# Altium project R01L_F.PrjPCB (part 2 of 3)

## Sheet 11_SDIO_SDMMC.SchDoc: P30L
size A3; Organization: 六零加智能科技; Address4: www.nidone.com.cn; DocumentNumber: kang jin; Revision: 1.0; SheetNumber: 11; SheetTotal: 23
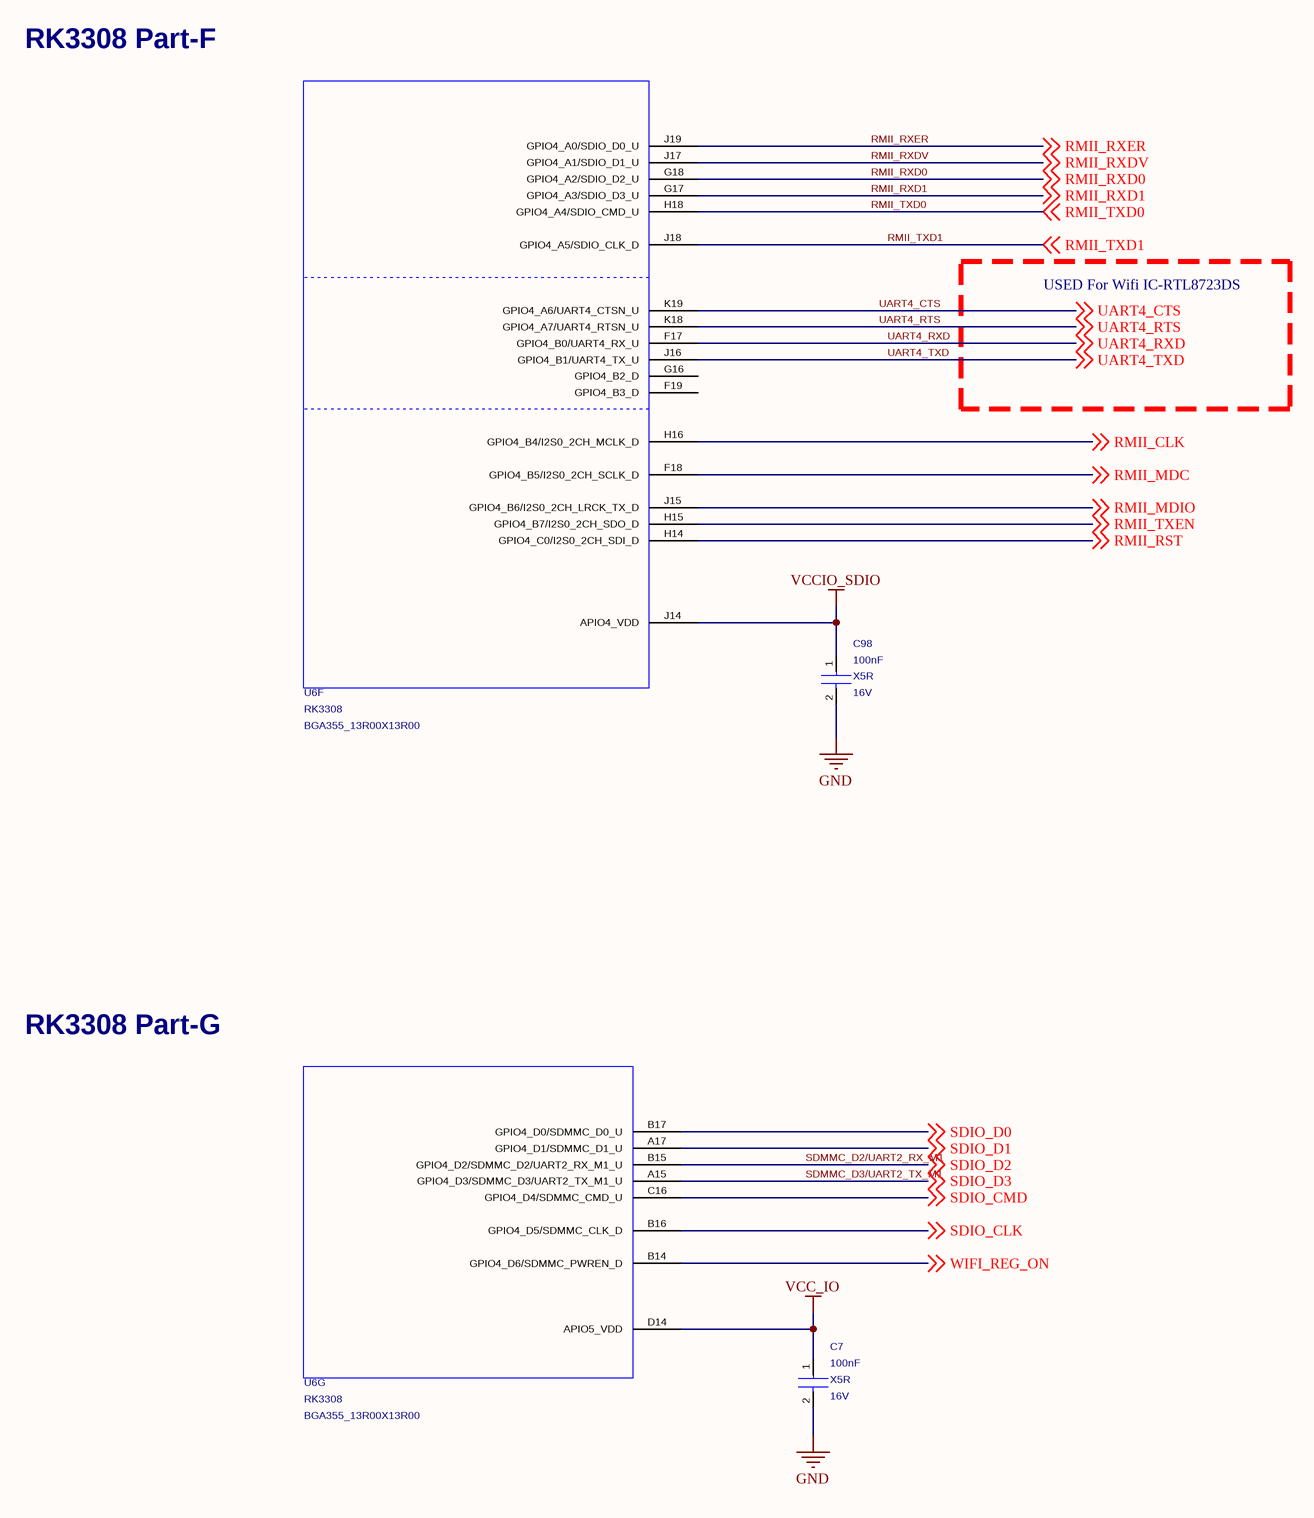
[diagram p19: 11_SDIO_SDMMC.SchDoc]

### Parts
C7  value 100nF  Voltage: 16V  Dielectric: X5R  [C0402]  (hidden comment: CAP_NP_2)
C98  value 100nF  Dielectric: X5R  Voltage: 16V  [C0402]  (hidden comment: CAP_NP_2)
U6  RK3308  [BGA355_13R00X13R00]  (parts F,G of 14)

### Nets
GND: C7.2 C98.2
VCC_IO: C7.1 C98.1 U6.D14(APIO5_VDD) U6.J14(APIO4_VDD)  [also labelled VCCIO_SDIO]
RMII_CLK: U6.H16(GPIO4_B4/I2S0_2CH_MCLK_D) ; off-sheet RMII_CLK
RMII_MDC: U6.F18(GPIO4_B5/I2S0_2CH_SCLK_D) ; off-sheet RMII_MDC
RMII_MDIO: U6.J15(GPIO4_B6/I2S0_2CH_LRCK_TX_D) ; off-sheet RMII_MDIO
RMII_RST: U6.H14(GPIO4_C0/I2S0_2CH_SDI_D) ; off-sheet RMII_RST
RMII_RXD0: U6.G18(GPIO4_A2/SDIO_D2_U) ; off-sheet RMII_RXD0
RMII_RXD1: U6.G17(GPIO4_A3/SDIO_D3_U) ; off-sheet RMII_RXD1
RMII_RXDV: U6.J17(GPIO4_A1/SDIO_D1_U) ; off-sheet RMII_RXDV
RMII_RXER: U6.J19(GPIO4_A0/SDIO_D0_U) ; off-sheet RMII_RXER
RMII_TXD0: U6.H18(GPIO4_A4/SDIO_CMD_U) ; off-sheet RMII_TXD0
RMII_TXD1: U6.J18(GPIO4_A5/SDIO_CLK_D) ; off-sheet RMII_TXD1
RMII_TXEN: U6.H15(GPIO4_B7/I2S0_2CH_SDO_D) ; off-sheet RMII_TXEN
SDIO_CLK: U6.B16(GPIO4_D5/SDMMC_CLK_D) ; off-sheet SDIO_CLK
SDIO_CMD: U6.C16(GPIO4_D4/SDMMC_CMD_U) ; off-sheet SDIO_CMD  [project net RTL8723DS_CMD]
SDIO_D0: U6.B17(GPIO4_D0/SDMMC_D0_U) ; off-sheet SDIO_D0  [project net RTL8723DS_D0]
SDIO_D1: U6.A17(GPIO4_D1/SDMMC_D1_U) ; off-sheet SDIO_D1  [project net RTL8723DS_D1]
SDIO_D2: U6.B15(GPIO4_D2/SDMMC_D2/UART2_RX_M1_U) ; off-sheet SDIO_D2  [also labelled SDMMC_D2/UART2_RX_M1]  [project net RTL8723DS_D2]
SDIO_D3: U6.A15(GPIO4_D3/SDMMC_D3/UART2_TX_M1_U) ; off-sheet SDIO_D3  [also labelled SDMMC_D3/UART2_TX_M1]  [project net RTL8723DS_D3]
UART4_CTS: U6.K19(GPIO4_A6/UART4_CTSN_U) ; off-sheet UART4_CTS
UART4_RTS: U6.K18(GPIO4_A7/UART4_RTSN_U) ; off-sheet UART4_RTS
UART4_RXD: U6.F17(GPIO4_B0/UART4_RX_U) ; off-sheet UART4_RXD
UART4_TXD: U6.J16(GPIO4_B1/UART4_TX_U) ; off-sheet UART4_TXD
WIFI_REG_ON: U6.B14(GPIO4_D6/SDMMC_PWREN_D) ; off-sheet WIFI_REG_ON

Not connected (* = marked no-connect by the designer): U6 F19(GPIO4_B3_D) G16(GPIO4_B2_D)

### Notes on the sheet
- RK3308 Part-F
- USED For Wifi IC-RTL8723DS
- RK3308 Part-G
- Title
- Size:
- Date:
- A3
- Engineer:
- Time:
- Revision:
- Sheet
- of
- File:

### Library data of the parts
C7 = CAP_NP_2: as C46 on sheet 04_POWER; PCB DECAL: C0402; Part_Type: C0402; RK_PN: C1005X5R1C104K050BA
C98 = CAP_NP_2: as C48 on sheet 04_POWER; PCB DECAL: C0402; Part_Type: C0402; Manufacturer_PN: C1005X5R1C104K050BA
U6 = RK3308: as U6 on sheet 04_POWER; Manufacturer_PN: RK3308; PCB DECAL: BGA355_13R00X13R00; Value: RK3308

## Sheet 12_GPIO_I2S0_PDM_SPDIF.SchDoc: P30L
size A2; Organization: 六零加智能科技; Address4: www.nidone.com.cn; DocumentNumber: Kang jin; Revision: 1.0; SheetNumber: 12; SheetTotal: 23
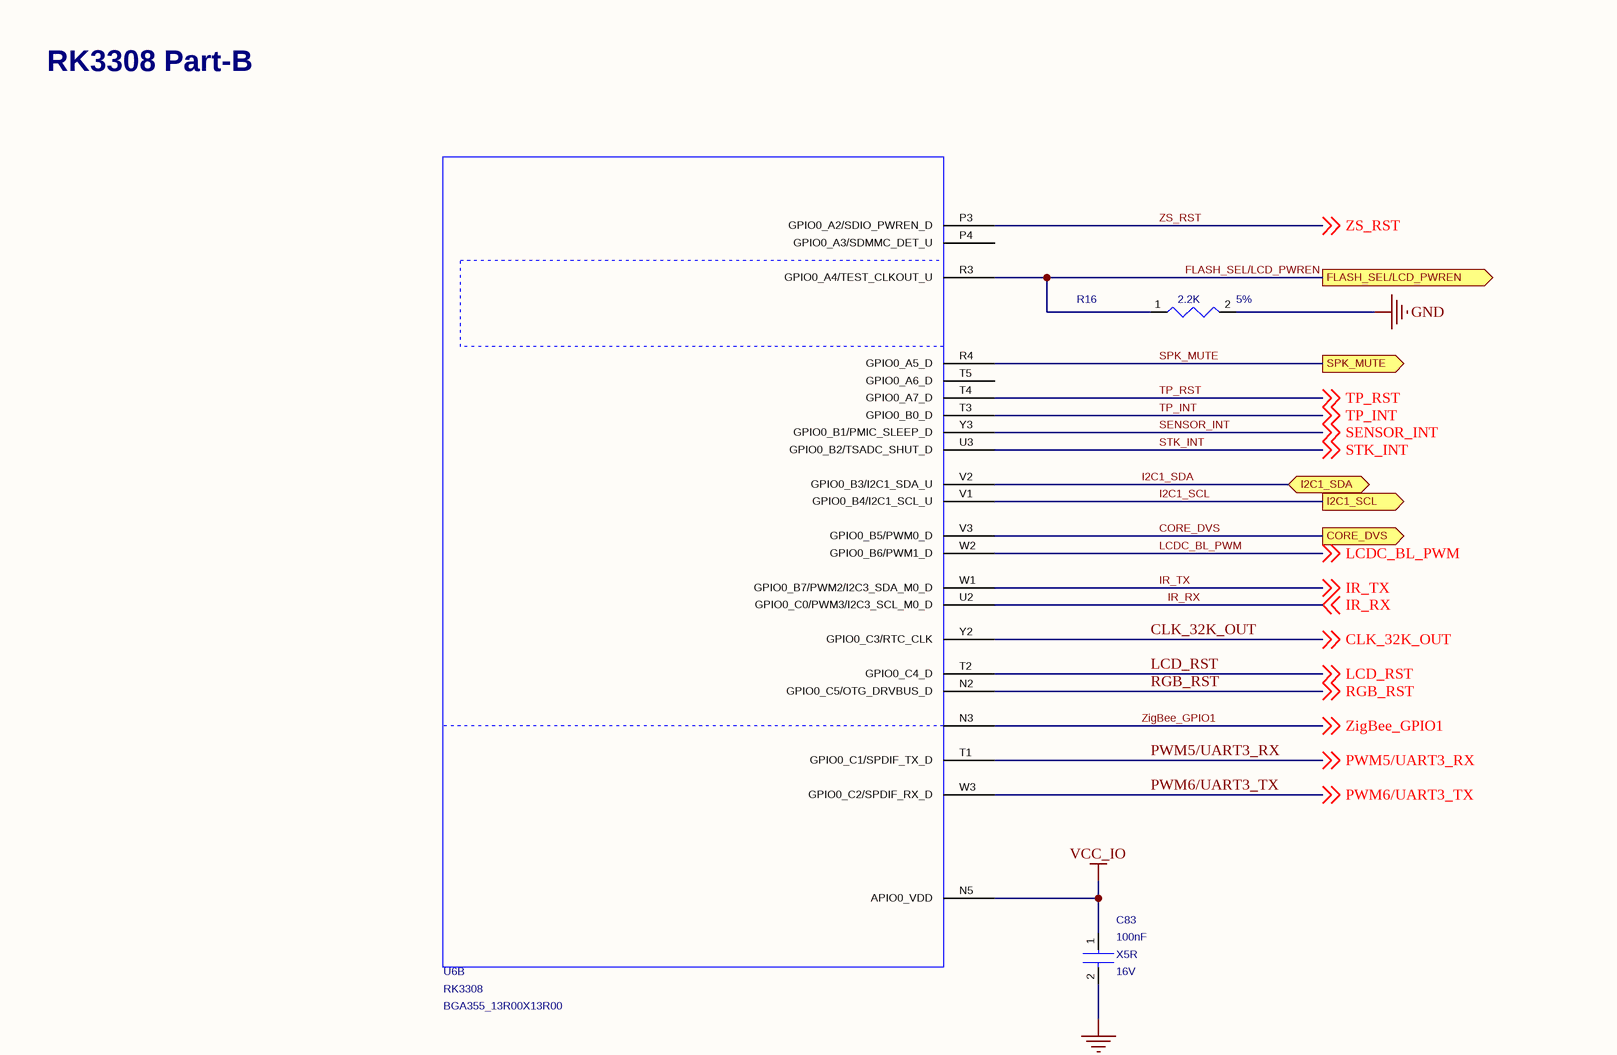
[diagram p20: 12_GPIO_I2S0_PDM_SPDIF.SchDoc, top left]
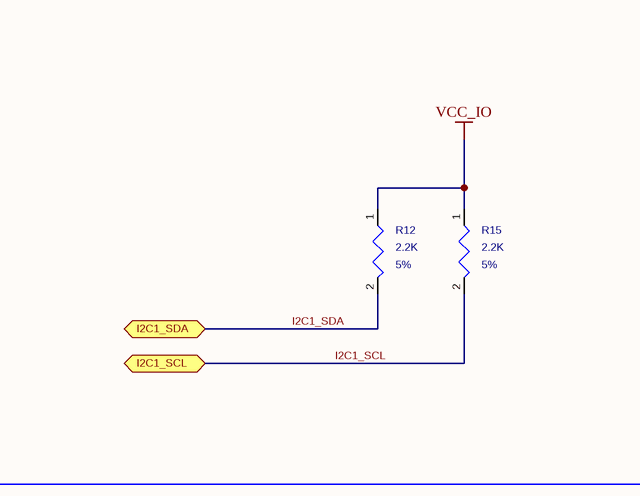
[diagram p21: 12_GPIO_I2S0_PDM_SPDIF.SchDoc, top right]
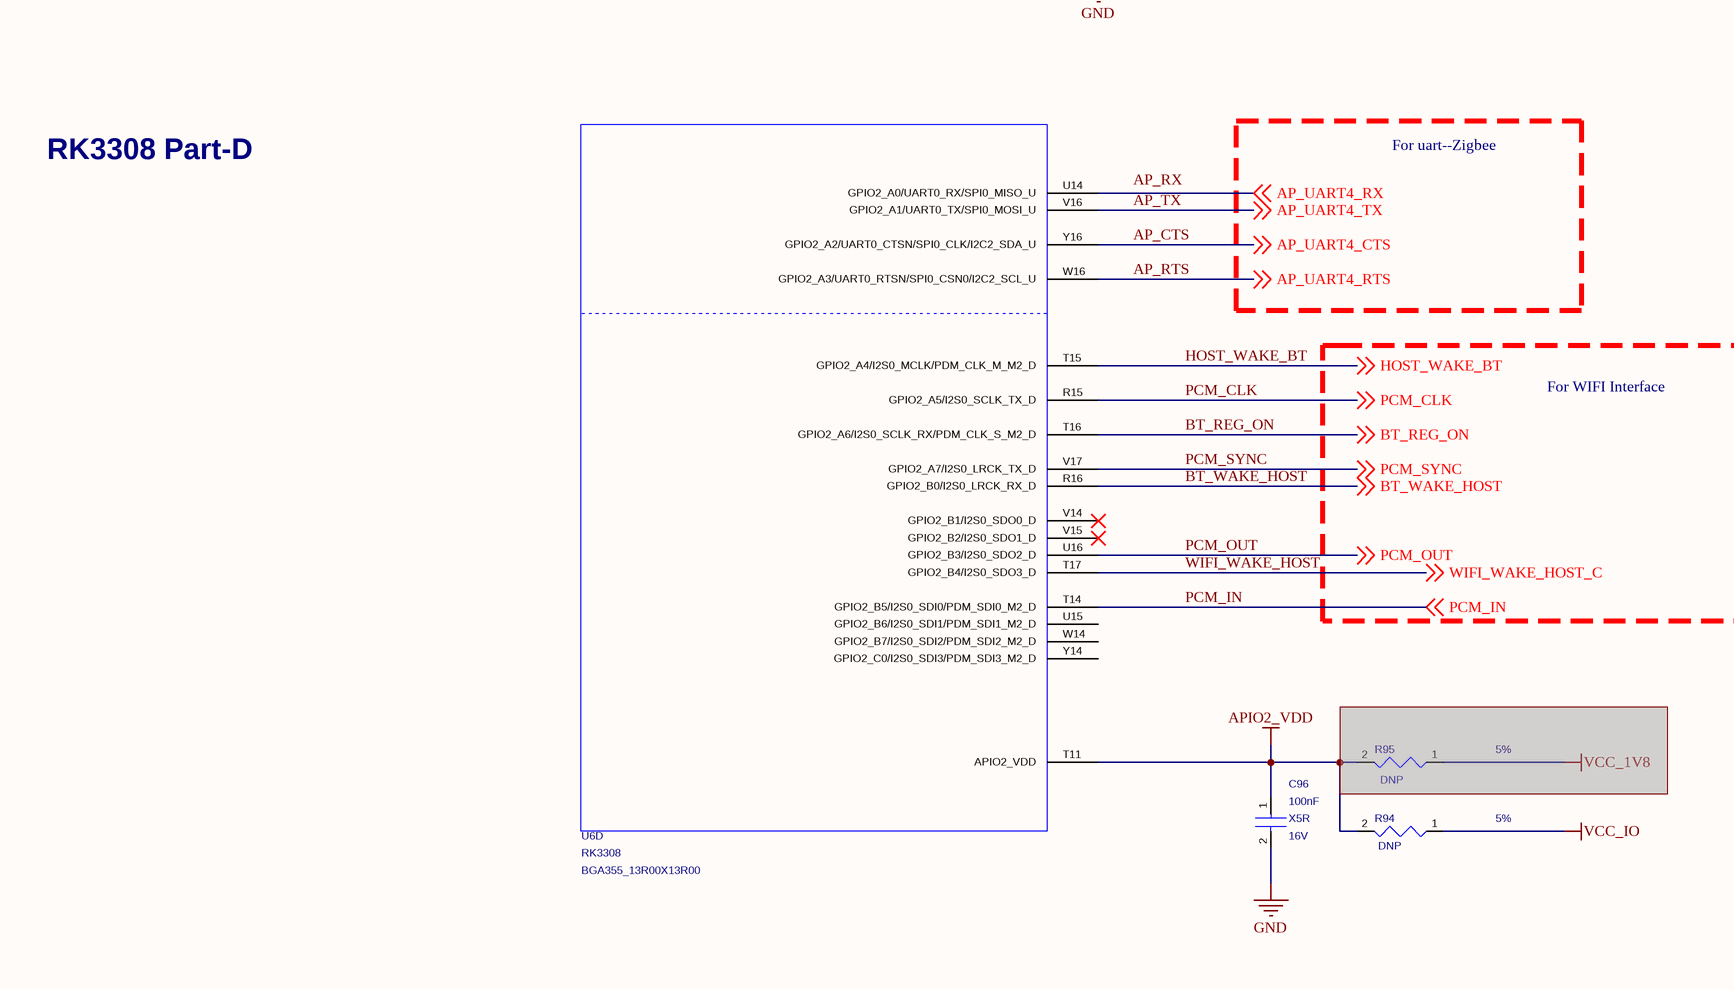
[diagram p22: 12_GPIO_I2S0_PDM_SPDIF.SchDoc, bottom left]

### Parts
C83  value 100nF  Voltage: 16V  Dielectric: X5R  [C0402]  (hidden comment: CAP_NP_2)
C96  value 100nF  Dielectric: X5R  Voltage: 16V  [C0402]  (hidden comment: CAP_NP_2)
R12  value 2.2K  Tolerance: 5%  [R0402]  (hidden comment: RESISTOR)
R15  value 2.2K  Tolerance: 5%  [R0402]  (hidden comment: RESISTOR)
R16  value 2.2K  Tolerance: 5%  [R0402]  (hidden comment: RESISTOR)
R94  Tolerance: 5%  Option: DNP  [R0402]  (hidden comment: RESISTOR)
R95  Tolerance: 5%  Option: DNP  [R0402]  (hidden comment: RESISTOR)  (masked out: inside a compile mask, not in the netlist)
U6  RK3308  [BGA355_13R00X13R00]  (parts B,D of 14)

### Ports
CORE_DVS (out), FLASH_SEL/LCD_PWREN (out), I2C1_SCL (bidir), I2C1_SCL (out), I2C1_SDA (bidir), SPK_MUTE (out)

### Nets
APIO2_VDD: C96.1 R94.2 U6.T11(APIO2_VDD)
GND: C83.2 C96.2 R16.2
VCC_IO: C83.1 R12.1 R15.1 R94.1 U6.N5(APIO0_VDD)
AP_CTS: U6.Y16(GPIO2_A2/UART0_CTSN/SPI0_CLK/I2C2_SDA_U) ; off-sheet AP_UART4_CTS  [also labelled AP_UART4_CTS]
AP_RTS: U6.W16(GPIO2_A3/UART0_RTSN/SPI0_CSN0/I2C2_SCL_U) ; off-sheet AP_UART4_RTS  [also labelled AP_UART4_RTS]
AP_TX: U6.V16(GPIO2_A1/UART0_TX/SPI0_MOSI_U) ; off-sheet AP_UART4_TX  [also labelled AP_UART4_TX]
AP_UART4_RX: U6.U14(GPIO2_A0/UART0_RX/SPI0_MISO_U) ; off-sheet AP_UART4_RX
BT_REG_ON: U6.T16(GPIO2_A6/I2S0_SCLK_RX/PDM_CLK_S_M2_D) ; off-sheet BT_REG_ON
BT_WAKE_HOST: U6.R16(GPIO2_B0/I2S0_LRCK_RX_D) ; off-sheet BT_WAKE_HOST
CLK_32K_OUT: U6.Y2(GPIO0_C3/RTC_CLK) ; off-sheet CLK_32K_OUT
CORE_DVS: U6.V3(GPIO0_B5/PWM0_D) ; port CORE_DVS
FLASH_SEL/LCD_PWREN: R16.1 U6.R3(GPIO0_A4/TEST_CLKOUT_U) ; port FLASH_SEL/LCD_PWREN
HOST_WAKE_BT: U6.T15(GPIO2_A4/I2S0_MCLK/PDM_CLK_M_M2_D) ; off-sheet HOST_WAKE_BT
I2C1_SCL: R15.2 U6.V1(GPIO0_B4/I2C1_SCL_U) ; port I2C1_SCL
I2C1_SDA: R12.2 U6.V2(GPIO0_B3/I2C1_SDA_U) ; port I2C1_SDA
IR_RX: U6.U2(GPIO0_C0/PWM3/I2C3_SCL_M0_D) ; off-sheet IR_RX
IR_TX: U6.W1(GPIO0_B7/PWM2/I2C3_SDA_M0_D) ; off-sheet IR_TX
LCD_RST: U6.T2(GPIO0_C4_D) ; off-sheet LCD_RST
LCDC_BL_PWM: U6.W2(GPIO0_B6/PWM1_D) ; off-sheet LCDC_BL_PWM
PCM_CLK: U6.R15(GPIO2_A5/I2S0_SCLK_TX_D) ; off-sheet PCM_CLK
PCM_IN: U6.T14(GPIO2_B5/I2S0_SDI0/PDM_SDI0_M2_D) ; off-sheet PCM_IN
PCM_OUT: U6.U16(GPIO2_B3/I2S0_SDO2_D) ; off-sheet PCM_OUT
PCM_SYNC: U6.V17(GPIO2_A7/I2S0_LRCK_TX_D) ; off-sheet PCM_SYNC
PWM5/UART3_RX: U6.T1(GPIO0_C1/SPDIF_TX_D) ; off-sheet PWM5/UART3_RX
PWM6/UART3_TX: U6.W3(GPIO0_C2/SPDIF_RX_D) ; off-sheet PWM6/UART3_TX
RGB_RST: U6.N2(GPIO0_C5/OTG_DRVBUS_D) ; off-sheet RGB_RST
SENSOR_INT: U6.Y3(GPIO0_B1/PMIC_SLEEP_D) ; off-sheet SENSOR_INT  [project net CH_INT]
SPK_MUTE: U6.R4(GPIO0_A5_D) ; port SPK_MUTE
STK_INT: U6.U3(GPIO0_B2/TSADC_SHUT_D) ; off-sheet STK_INT
TP_INT: U6.T3(GPIO0_B0_D) ; off-sheet TP_INT
TP_RST: U6.T4(GPIO0_A7_D) ; off-sheet TP_RST
WIFI_WAKE_HOST: U6.T17(GPIO2_B4/I2S0_SDO3_D) ; off-sheet WIFI_WAKE_HOST_C  [also labelled WIFI_WAKE_HOST_C]
ZigBee_GPIO1: U6.N3 ; off-sheet ZigBee_GPIO1  [project net RS485_EN]
ZS_RST: U6.P3(GPIO0_A2/SDIO_PWREN_D) ; off-sheet ZS_RST

Not connected (* = marked no-connect by the designer): U6 P4(GPIO0_A3/SDMMC_DET_U) T5(GPIO0_A6_D) U15(GPIO2_B6/I2S0_SDI1/PDM_SDI1_M2_D) V14(GPIO2_B1/I2S0_SDO0_D)* V15(GPIO2_B2/I2S0_SDO1_D)* W14(GPIO2_B7/I2S0_SDI2/PDM_SDI2_M2_D) Y14(GPIO2_C0/I2S0_SDI3/PDM_SDI3_M2_D)

### Notes on the sheet
- RK3308 Part-B
- RK3308 Part-D
- For uart--Zigbee
- For WIFI Interface
- Labels drawn without touching a wire or pin: AP_RX
- Title
- Size:
- Date:
- File:
- A2
- Engineer:
- Time:
- Revision:
- Sheet
- of

### Library data of the parts
C83 = CAP_NP_2: as C46 on sheet 04_POWER; Part_Type: C0402; RK_PN: C1005X5R1C104K050BA; PCB DECAL: C0402
C96 = CAP_NP_2: as C48 on sheet 04_POWER; Part_Type: C0402; Manufacturer_PN: C1005X5R1C104K050BA; PCB DECAL: C0402
R12 = RESISTOR: ?用厚膜电阻,2K2,+/-5%,R0402,1/16W.; Manufacturer_PN: RC0402JR-072K2L; Manufacturer: YAGEO; Created_by: YTL; Wattage: 1/16W; Priority: A; Source_Path: Z:\RK_STANDARD_LIBRARY\CADENCE_CIS\RK_DISCRETE.OLB; Part_Type: ?用厚膜电阻; RK_PN: RC0402JR-072K2L; PCB DECAL: R0402
R15 = RESISTOR: ?用厚膜电阻,2K2,+/-5%,R0402,1/16W.; Manufacturer: YAGEO; RK_PN: RC0402JR-072K2L; Priority: A; Wattage: 1/16W; Created_by: YTL; Source_Path: Z:\RK_STANDARD_LIBRARY\CADENCE_CIS\RK_DISCRETE.OLB; Part_Type: ?用厚膜电阻; Manufacturer_PN: RC0402JR-072K2L; PCB DECAL: R0402
R16 = RESISTOR: ?用厚膜电阻,2.2K,+/-5%,R0402,1/16W.; Manufacturer: YAGEO; RK_PN: RC0402JR-070RL; Priority: A; Wattage: 1/16W; Created_by: YTL; Source_Path: Z:\RK_STANDARD_LIBRARY\CADENCE_CIS\RK_DISCRETE.OLB; Number: 1; Part_Type: ?用厚膜电阻; Manufacturer_PN: RC0402JR-070RL; PCB DECAL: R0402
R94 R95 = RESISTOR: ?用厚膜电阻,0R,+/-5%,R0402,1/16W.; Manufacturer: YAGEO; RK_PN: RC0402JR-070RL; Priority: A; Wattage: 1/16W; Created_by: YTL; Source_Path: Z:\RK_STANDARD_LIBRARY\CADENCE_CIS\RK_DISCRETE.OLB; Number: 1; Part_Type: ?用厚膜电阻; Manufacturer_PN: RC0402JR-070RL; PCB DECAL: R0402; Value: 0R
U6 = RK3308: as U6 on sheet 04_POWER; Manufacturer_PN: RK3308; PCB DECAL: BGA355_13R00X13R00; Value: RK3308

## Sheet 13_ACODEC.SchDoc: P30L
size A2; Organization: 六零加智能科技; Address4: www.nidone.com.cn; DocumentNumber: kang jin; Revision: 1.0; SheetNumber: 13; SheetTotal: 23
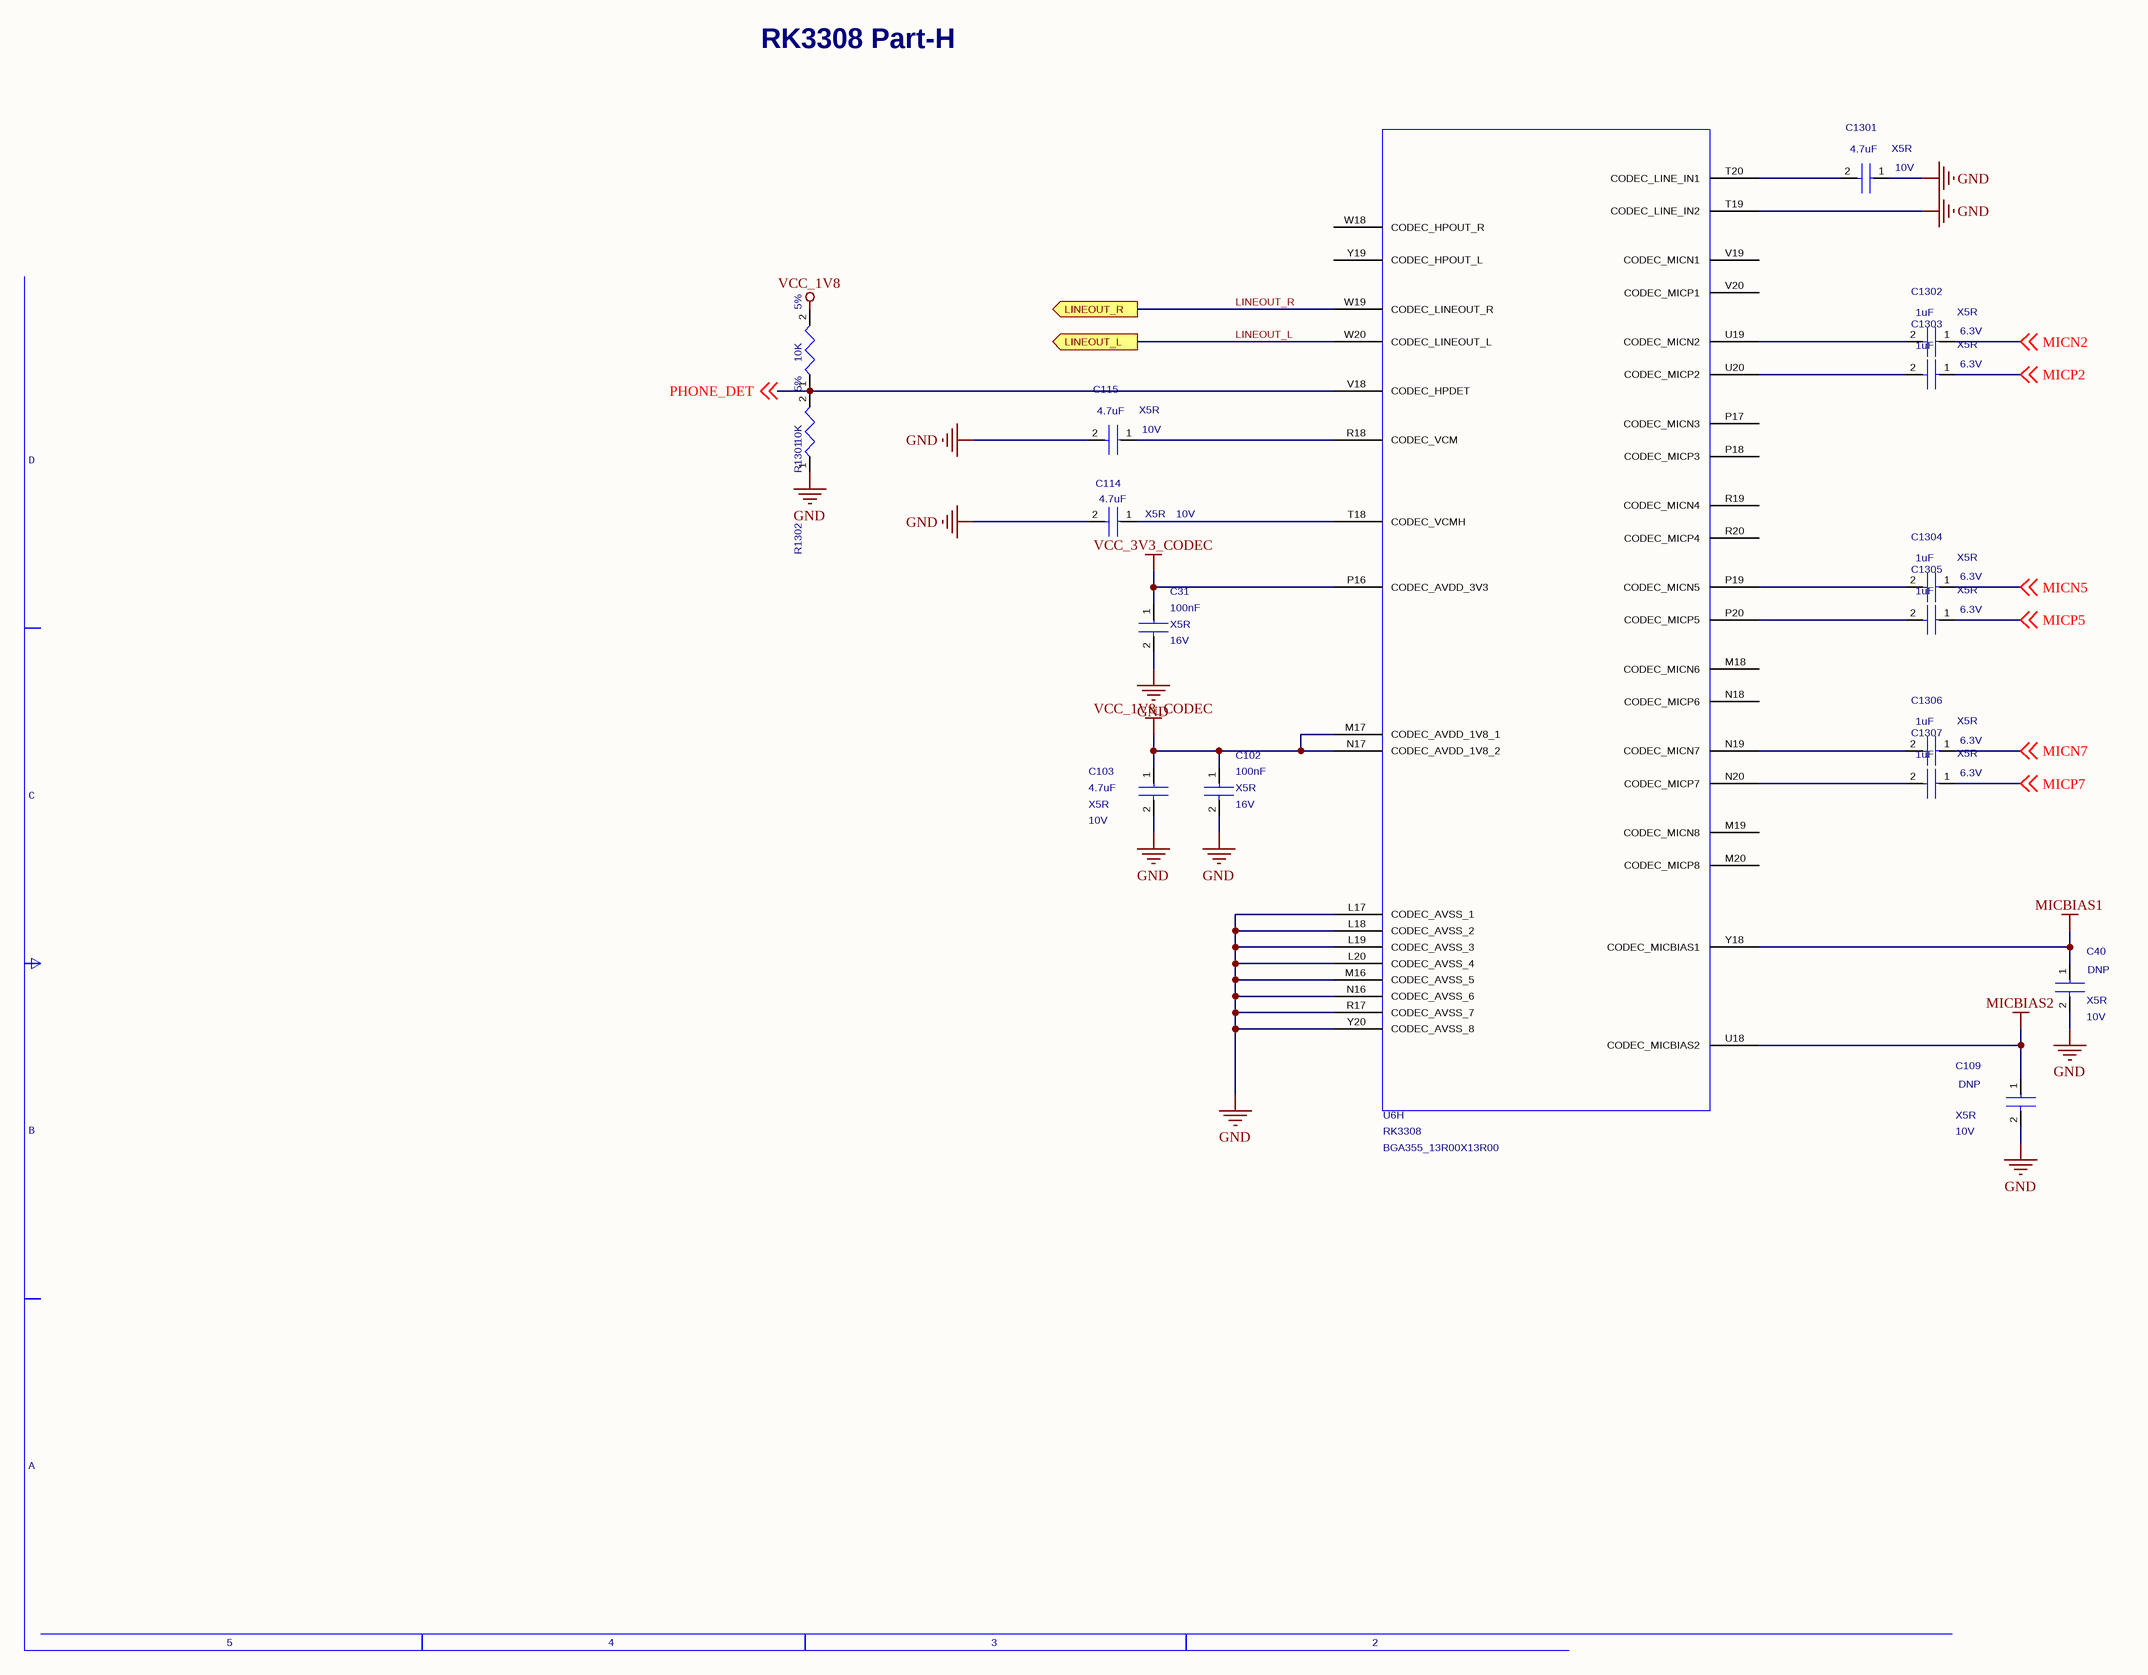
[diagram p23: 13_ACODEC.SchDoc]

### Parts
C31  value 100nF  Voltage: 16V  Dielectric: X5R  [C0402]  (hidden comment: CAP_NP_2)
C40  Dielectric: X5R  Voltage: 10V  Option: DNP  [C0402]  (hidden comment: CAP_NP_2)
C102  value 100nF  Dielectric: X5R  Voltage: 16V  [C0402]  (hidden comment: CAP_NP_2)
C103  value 4.7uF  Dielectric: X5R  Voltage: 10V  [C0402]  (hidden comment: CAP_NP_2)
C109  Voltage: 10V  Dielectric: X5R  Option: DNP  [C0402]  (hidden comment: CAP_NP_2)
C114  value 4.7uF  Voltage: 10V  Dielectric: X5R  [C0603]  (hidden comment: CAP_NP_2)
C115  value 4.7uF  Voltage: 10V  Dielectric: X5R  [C0603]  (hidden comment: CAP_NP_2)
C1301  value 4.7uF  Voltage: 10V  Dielectric: X5R  [C0603]  (hidden comment: CAP_NP_2)
C1302  value 1uF  Voltage: 6.3V  Dielectric: X5R  [C0402]  (hidden comment: CAP_NP_2)
C1303  value 1uF  Voltage: 6.3V  Dielectric: X5R  [C0402]  (hidden comment: CAP_NP_2)
C1304  value 1uF  Voltage: 6.3V  Dielectric: X5R  [C0402]  (hidden comment: CAP_NP_2)
C1305  value 1uF  Voltage: 6.3V  Dielectric: X5R  [C0402]  (hidden comment: CAP_NP_2)
C1306  value 1uF  Voltage: 6.3V  Dielectric: X5R  [C0402]  (hidden comment: CAP_NP_2)
C1307  value 1uF  Voltage: 6.3V  Dielectric: X5R  [C0402]  (hidden comment: CAP_NP_2)
R1301  value 10K  Tolerance: 5%  [R0402]  (hidden comment: RESISTOR)
R1302  value 10K  Tolerance: 5%  [R0402]  (hidden comment: RESISTOR)
U6  RK3308  [BGA355_13R00X13R00]  (part H of 14)

### Ports
LINEOUT_L (out), LINEOUT_R (out)

### Nets
GND: C31.2 C40.2 C102.2 C103.2 C109.2 C114.2 C115.2 C1301.1 R1302.1 U6.L17(CODEC_AVSS_1) U6.L18(CODEC_AVSS_2) U6.L19(CODEC_AVSS_3) U6.L20(CODEC_AVSS_4) U6.M16(CODEC_AVSS_5) U6.N16(CODEC_AVSS_6) U6.R17(CODEC_AVSS_7) U6.T19(CODEC_LINE_IN2) U6.Y20(CODEC_AVSS_8)
MICBIAS1: C40.1 U6.Y18(CODEC_MICBIAS1)
MICBIAS2: C109.1 U6.U18(CODEC_MICBIAS2)
VCC_1V8: R1301.2
VCC_1V8_CODEC: C102.1 C103.1 U6.M17(CODEC_AVDD_1V8_1) U6.N17(CODEC_AVDD_1V8_2)
VCC_3V3_CODEC: C31.1 U6.P16(CODEC_AVDD_3V3)
LINEOUT_L: U6.W20(CODEC_LINEOUT_L) ; port LINEOUT_L
LINEOUT_R: U6.W19(CODEC_LINEOUT_R) ; port LINEOUT_R
MICN2: C1302.1 ; off-sheet MICN2
MICN5: C1304.1 ; off-sheet MICN5
MICN7: C1306.1 ; off-sheet MICN7
MICP2: C1303.1 ; off-sheet MICP2
MICP5: C1305.1 ; off-sheet MICP5
MICP7: C1307.1 ; off-sheet MICP7
PHONE_DET: R1301.1 R1302.2 U6.V18(CODEC_HPDET) ; off-sheet PHONE_DET
NetC114_1: C114.1 U6.T18(CODEC_VCMH)
NetC115_1: C115.1 U6.R18(CODEC_VCM)
NetC1301_2: C1301.2 U6.T20(CODEC_LINE_IN1)
NetC1302_2: C1302.2 U6.U19(CODEC_MICN2)
NetC1303_2: C1303.2 U6.U20(CODEC_MICP2)
NetC1304_2: C1304.2 U6.P19(CODEC_MICN5)
NetC1305_2: C1305.2 U6.P20(CODEC_MICP5)
NetC1306_2: C1306.2 U6.N19(CODEC_MICN7)
NetC1307_2: C1307.2 U6.N20(CODEC_MICP7)

Not connected (* = marked no-connect by the designer): U6 M18(CODEC_MICN6) M19(CODEC_MICN8) M20(CODEC_MICP8) N18(CODEC_MICP6) P17(CODEC_MICN3) P18(CODEC_MICP3) R19(CODEC_MICN4) R20(CODEC_MICP4) V19(CODEC_MICN1) V20(CODEC_MICP1) W18(CODEC_HPOUT_R) Y19(CODEC_HPOUT_L)

### Notes on the sheet
- RK3308 Part-H
- D
- C
- B
- A
- 5
- 4
- 3
- 2
- Title
- Size:
- Date:
- File:
- A2
- Engineer:
- Time:
- Revision:
- Sheet
- of

### Library data of the parts
C31 = CAP_NP_2: cap,100.00nF,+/-10%,16V,X5R,C0402; Manufacturer_PN: C1005X5R1C104K050BA; Manufacturer: TDK; Created_by: JJJ; Tolerance: 10%; Priority: A; Source_Path: Z:\RK_STANDARD_LIBRARY\CADENCE_CIS\RK_DISCRETE.OLB; Number: 1; PCB DECAL: C0402; Part_Type: C0402; RK_PN: C1005X5R1C104K050BA
C40 = CAP_NP_2: cap,1.00uF,+/-10%,10V,X5R,C0402; Manufacturer: TDK; RK_PN: C1005X5R1A105K050BB; Priority: A; Tolerance: 10%; Created_by: JJJ; Source_Path: Z:\RK_STANDARD_LIBRARY\CADENCE_CIS\RK_DISCRETE.OLB; Value: 1uF; Number: 1; PCB DECAL: C0402; Part_Type: C0402; Manufacturer_PN: C1005X5R1A105K050BB
C102 = CAP_NP_2: cap,100.00nF,+/-10%,16V,X5R,C0402; Manufacturer: TDK; RK_PN: C1005X5R1C104K050BA; Priority: A; Tolerance: 10%; Created_by: JJJ; Source_Path: Z:\RK_STANDARD_LIBRARY\CADENCE_CIS\RK_DISCRETE.OLB; Number: 1; PCB DECAL: C0402; Part_Type: C0402; Manufacturer_PN: C1005X5R1C104K050BA
C103 = CAP_NP_2: cap,4.70uF,+/-10%,10V,X5R,C0402; Manufacturer: TDK; RK_PN: C1005X5R1A475K050BC; Priority: A; Tolerance: 10%; Created_by: JJJ; Source_Path: Z:\RK_STANDARD_LIBRARY\CADENCE_CIS\RK_DISCRETE.OLB; Number: 1; PCB DECAL: C0402; Part_Type: C0402; Manufacturer_PN: C1005X5R1A475K050BC
C109 = CAP_NP_2: cap,1.00uF,+/-10%,10V,X5R,C0402; Manufacturer_PN: C1005X5R1A105K050BB; Manufacturer: TDK; Created_by: JJJ; Tolerance: 10%; Priority: A; Source_Path: Z:\RK_STANDARD_LIBRARY\CADENCE_CIS\RK_DISCRETE.OLB; Value: 1uF; Number: 1; PCB DECAL: C0402; Part_Type: C0402; RK_PN: C1005X5R1A105K050BB
C114 C115 C1301 = CAP_NP_2: cap,4.70uF,+/-10%,10V,X5R,C0603; Manufacturer_PN: C1608X5R1A475K080AC; Manufacturer: TDK; Created_by: JJJ; Tolerance: 10%; Priority: A; Source_Path: Z:\RK_STANDARD_LIBRARY\CADENCE_CIS\RK_DISCRETE.OLB; Number: 1; PCB DECAL: C0603; Part_Type: C0603; RK_PN: C1608X5R1A475K080AC
C1302-C1307 = CAP_NP_2: cap,1uF,+/-10%,10V,X5R,C0402; Manufacturer_PN: C1608X5R1A475K080AC; Manufacturer: TDK; Created_by: JJJ; Tolerance: 10%; Priority: A; Source_Path: Z:\RK_STANDARD_LIBRARY\CADENCE_CIS\RK_DISCRETE.OLB; Number: 1; PCB DECAL: C0402; Part_Type: C0402; RK_PN: C1608X5R1A475K080AC
R1301 = RESISTOR: ?用厚膜电阻,2.2K,+/-5%,R0402,1/16W.; Manufacturer: YAGEO; RK_PN: RC0402JR-070RL; Priority: A; Wattage: 1/16W; Created_by: YTL; Source_Path: Z:\RK_STANDARD_LIBRARY\CADENCE_CIS\RK_DISCRETE.OLB; Number: 1; Part_Type: ?用厚膜电阻; Manufacturer_PN: RC0402JR-070RL; PCB DECAL: R0402
R1302 = RESISTOR: ?用厚膜电阻,10K,+/-5%,R0402,1/16W.; Manufacturer: YAGEO; RK_PN: RC0402JR-070RL; Priority: A; Wattage: 1/16W; Created_by: YTL; Source_Path: Z:\RK_STANDARD_LIBRARY\CADENCE_CIS\RK_DISCRETE.OLB; Number: 1; Part_Type: ?用厚膜电阻; Manufacturer_PN: RC0402JR-070RL; PCB DECAL: R0402
U6 = RK3308: Manufacturer: ROCKCHIP; Source_Path: E:\SCHEMETIC\RKSCH.OLB; Number: 1; Manufacturer_PN: RK3308; PCB DECAL: BGA355_13R00X13R00; Value: RK3308

## Sheet 14_RAM-DDR3_1X16BIT.SchDoc: P30L
size A3; Organization: 六零加智能科技; Address4: www.nidone.com.cn; DocumentNumber: kang jin; Revision: 1.0; SheetNumber: 14; SheetTotal: 23
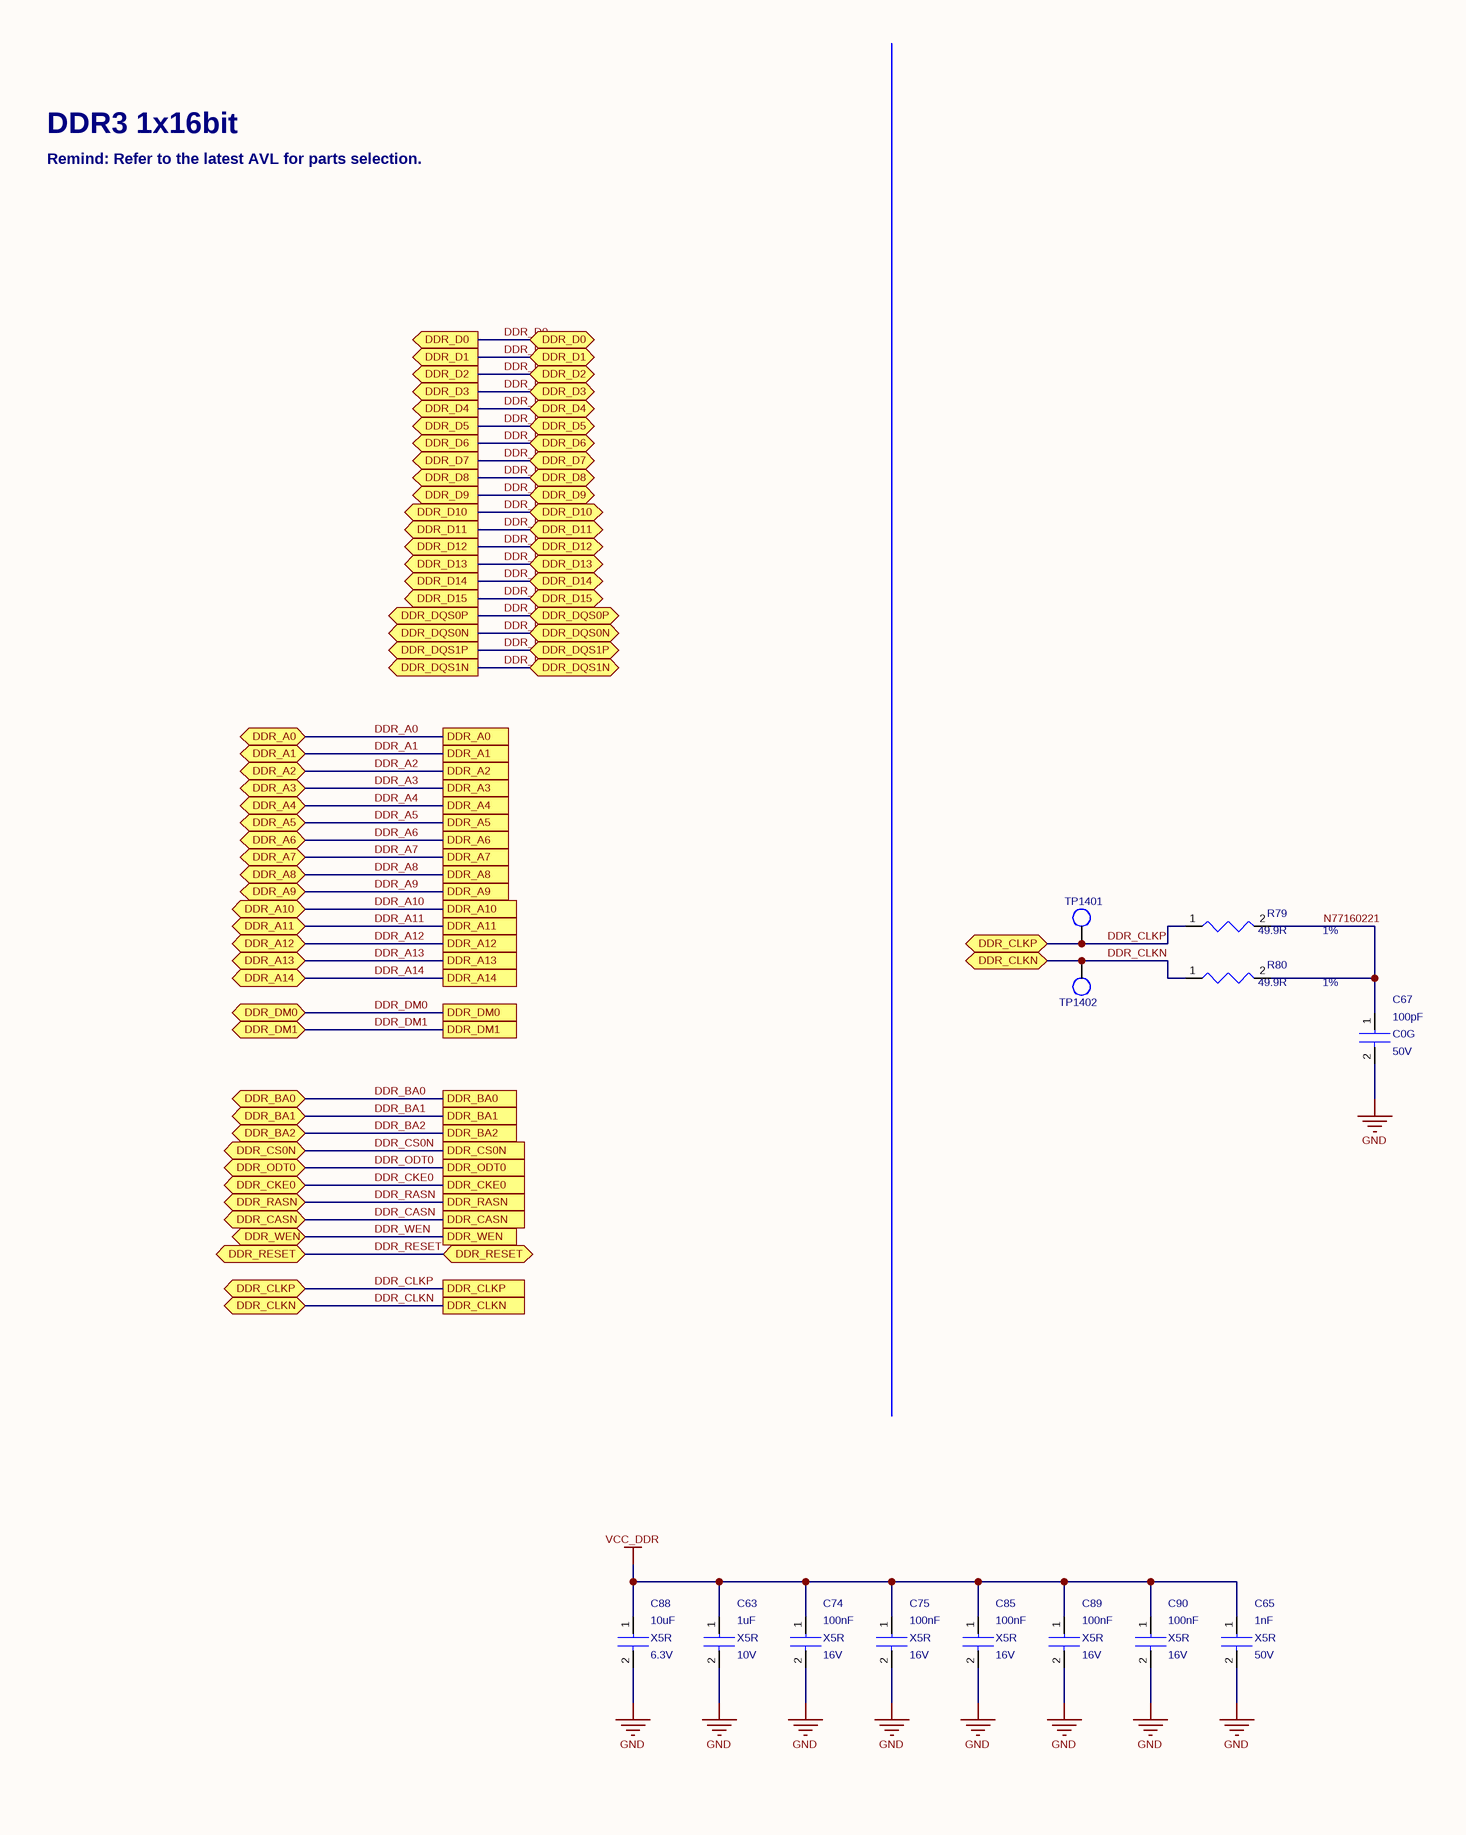
[diagram p24: 14_RAM-DDR3_1X16BIT.SchDoc, left]
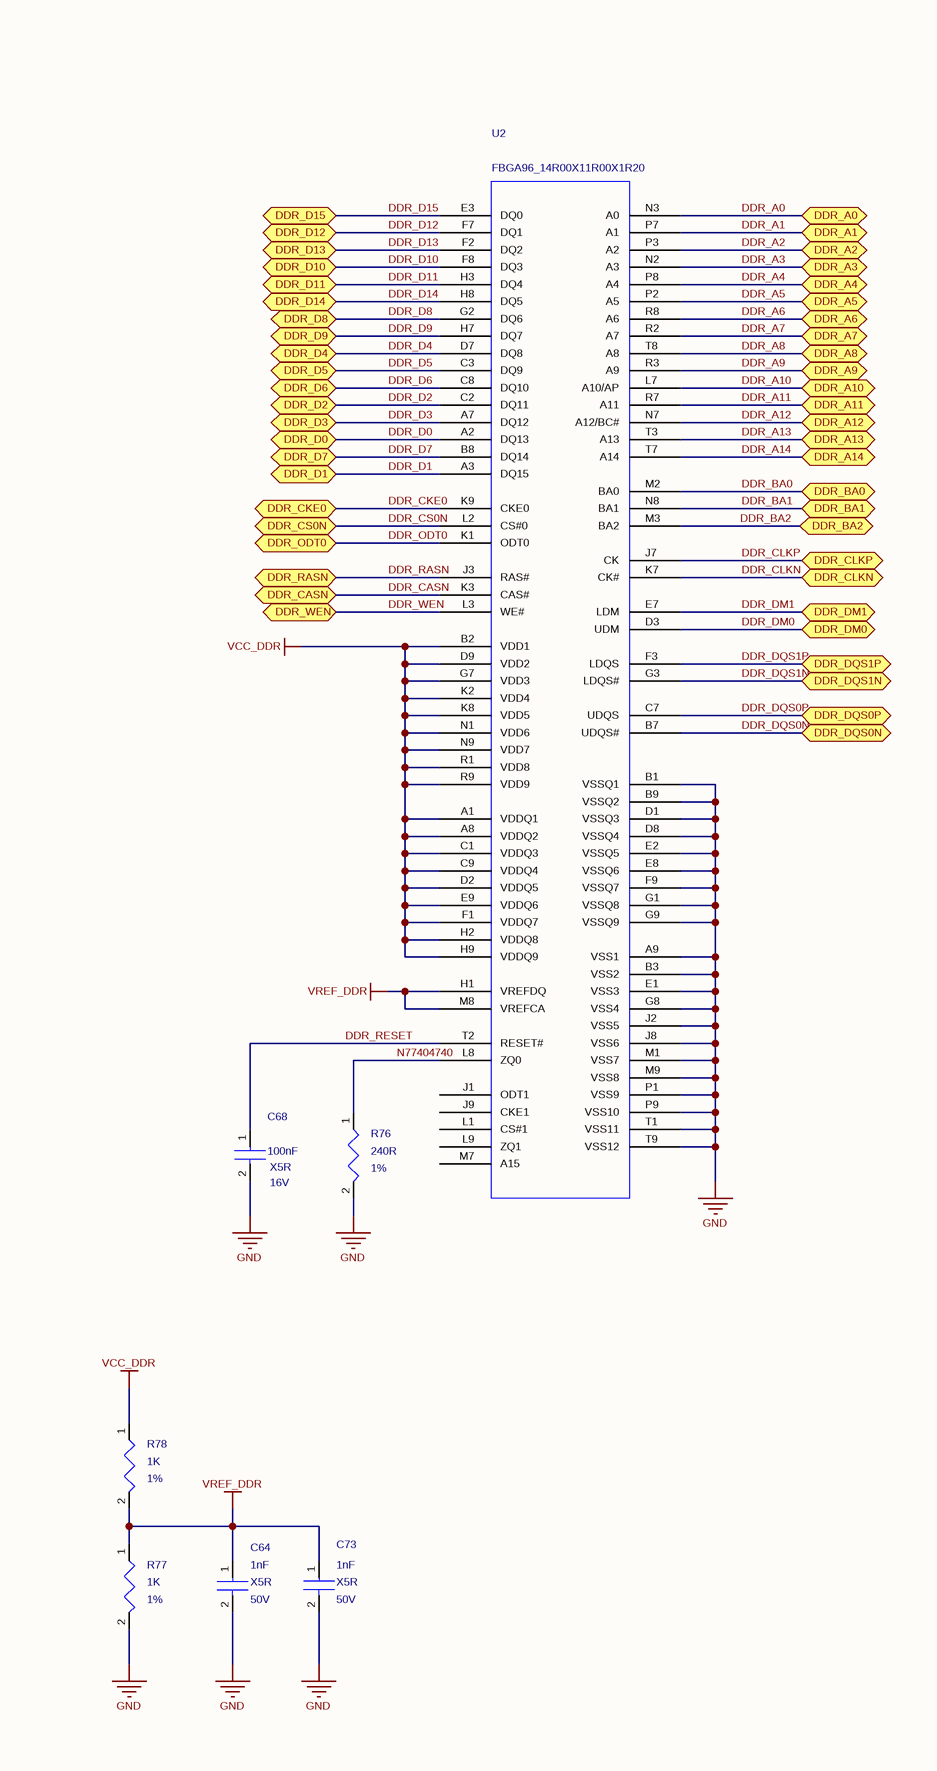
[diagram p25: 14_RAM-DDR3_1X16BIT.SchDoc, right]

### Parts
C63  value 1uF  Dielectric: X5R  Voltage: 10V  [C0402]  (hidden comment: CAP_NP_2)
C64  value 1nF  Voltage: 50V  Dielectric: X5R  [C0402]  (hidden comment: CAP_NP_2)
C65  value 1nF  Dielectric: X5R  Voltage: 50V  [C0402]  (hidden comment: CAP_NP_2)
C67  value 100pF  Voltage: 50V  Dielectric: C0G  [C0402]  (hidden comment: CAP_NP_2)
C68  value 100nF  Dielectric: X5R  Voltage: 16V  [C0402]  (hidden comment: CAP_NP_2)
C73  value 1nF  Voltage: 50V  Dielectric: X5R  [C0402]  (hidden comment: CAP_NP_2)
C74  value 100nF  Voltage: 16V  Dielectric: X5R  [C0402]  (hidden comment: CAP_NP_2)
C75  value 100nF  Voltage: 16V  Dielectric: X5R  [C0402]  (hidden comment: CAP_NP_2)
C85  value 100nF  Voltage: 16V  Dielectric: X5R  [C0402]  (hidden comment: CAP_NP_2)
C88  value 10uF  Voltage: 6.3V  Dielectric: X5R  [C0603]  (hidden comment: CAP_NP_2)
C89  value 100nF  Voltage: 16V  Dielectric: X5R  [C0402]  (hidden comment: CAP_NP_2)
C90  value 100nF  Dielectric: X5R  Voltage: 16V  [C0402]  (hidden comment: CAP_NP_2)
R76  value 240R  Tolerance: 1%  [R0402]  (hidden comment: RESISTOR)
R77  value 1K  Tolerance: 1%  [R0402]  (hidden comment: RESISTOR)
R78  value 1K  Tolerance: 1%  [R0402]  (hidden comment: RESISTOR)
R79  value 49.9R  Tolerance: 1%  [R0402]  (hidden comment: RESISTOR)
R80  value 49.9R  Tolerance: 1%  [R0402]  (hidden comment: RESISTOR)
TP1401  TP_0.7  [TEST]  (value not drawn)
TP1402  TP_0.7  [TEST]  (value not drawn)
U2  DDR3_16BIT  [FBGA96_14R00X11R00X1R20]  (value not drawn)

### Ports
DDR_A0, DDR_A0 (bidir), DDR_A1, DDR_A1 (bidir), DDR_A2, DDR_A2 (bidir), DDR_A3, DDR_A3 (bidir), DDR_A4, DDR_A4 (bidir), DDR_A5, DDR_A5 (bidir), DDR_A6, DDR_A6 (bidir), DDR_A7, DDR_A7 (bidir), DDR_A8, DDR_A8 (bidir), DDR_A9, DDR_A9 (bidir), DDR_A10, DDR_A10 (bidir), DDR_A11, DDR_A11 (bidir), DDR_A12, DDR_A12 (bidir), DDR_A13, DDR_A13 (bidir), DDR_A14, DDR_A14 (bidir), DDR_BA0, DDR_BA0 (bidir), DDR_BA1, DDR_BA1 (bidir), DDR_BA2, DDR_BA2 (bidir), DDR_CASN, DDR_CASN (bidir), DDR_CKE0, DDR_CKE0 (bidir), DDR_CLKN, DDR_CLKN (bidir), DDR_CLKP, DDR_CLKP (bidir), DDR_CS0N, DDR_CS0N (bidir), DDR_D0 (bidir), DDR_D0 (out), DDR_D1 (bidir), DDR_D1 (out), DDR_D2 (bidir), DDR_D2 (out), DDR_D3 (bidir), DDR_D3 (out), DDR_D4 (bidir), DDR_D4 (out), DDR_D5 (bidir), DDR_D5 (out), DDR_D6 (bidir), DDR_D6 (out), DDR_D7 (bidir), DDR_D7 (out), DDR_D8 (bidir), DDR_D8 (out), DDR_D9 (bidir), DDR_D9 (out), DDR_D10 (bidir), DDR_D10 (out), DDR_D11 (bidir), DDR_D11 (out), DDR_D12 (bidir), DDR_D12 (out), DDR_D13 (bidir), DDR_D13 (out), DDR_D14 (bidir), DDR_D14 (out), DDR_D15 (bidir), DDR_D15 (out), DDR_DM0, DDR_DM0 (bidir), DDR_DM1, DDR_DM1 (bidir), DDR_DQS0N (bidir), DDR_DQS0N (out), DDR_DQS0P (bidir), DDR_DQS0P (out), DDR_DQS1N (bidir), DDR_DQS1N (out), DDR_DQS1P (bidir), DDR_DQS1P (out), DDR_ODT0, DDR_ODT0 (bidir), DDR_RASN, DDR_RASN (bidir), DDR_RESET (bidir), DDR_WEN, DDR_WEN (bidir)

### Nets
GND: C63.2 C64.2 C65.2 C67.2 C68.2 C73.2 C74.2 C75.2 C85.2 C88.2 C89.2 C90.2 R76.2 R77.2 U2.A9(VSS1) U2.B1(VSSQ1) U2.B3(VSS2) U2.B9(VSSQ2) U2.D1(VSSQ3) U2.D8(VSSQ4) U2.E1(VSS3) U2.E2(VSSQ5) U2.E8(VSSQ6) U2.F9(VSSQ7) U2.G1(VSSQ8) U2.G8(VSS4) U2.G9(VSSQ9) U2.J2(VSS5) U2.J8(VSS6) U2.M1(VSS7) U2.M9(VSS8) U2.P1(VSS9) U2.P9(VSS10) U2.T1(VSS11) U2.T9(VSS12)
VCC_DDR: C63.1 C65.1 C74.1 C75.1 C85.1 C88.1 C89.1 C90.1 R78.1 U2.A1(VDDQ1) U2.A8(VDDQ2) U2.B2(VDD1) U2.C1(VDDQ3) U2.C9(VDDQ4) U2.D2(VDDQ5) U2.D9(VDD2) U2.E9(VDDQ6) U2.F1(VDDQ7) U2.G7(VDD3) U2.H2(VDDQ8) U2.H9(VDDQ9) U2.K2(VDD4) U2.K8(VDD5) U2.N1(VDD6) U2.N9(VDD7) U2.R1(VDD8) U2.R9(VDD9)
VREF_DDR: C64.1 C73.1 R77.1 R78.2 U2.H1(VREFDQ) U2.M8(VREFCA)
DDR_A0: U2.N3(A0) ; port DDR_A0
DDR_A1: U2.P7(A1) ; port DDR_A1
DDR_A2: U2.P3(A2) ; port DDR_A2
DDR_A3: U2.N2(A3) ; port DDR_A3
DDR_A4: U2.P8(A4) ; port DDR_A4
DDR_A5: U2.P2(A5) ; port DDR_A5
DDR_A6: U2.R8(A6) ; port DDR_A6
DDR_A7: U2.R2(A7) ; port DDR_A7
DDR_A8: U2.T8(A8) ; port DDR_A8
DDR_A9: U2.R3(A9) ; port DDR_A9
DDR_A10: U2.L7(A10/AP) ; port DDR_A10
DDR_A11: U2.R7(A11) ; port DDR_A11
DDR_A12: U2.N7(A12/BC#) ; port DDR_A12
DDR_A13: U2.T3(A13) ; port DDR_A13
DDR_A14: U2.T7(A14) ; port DDR_A14
DDR_BA0: U2.M2(BA0) ; port DDR_BA0
DDR_BA1: U2.N8(BA1) ; port DDR_BA1
DDR_BA2: U2.M3(BA2) ; port DDR_BA2
DDR_CASN: U2.K3(CAS#) ; port DDR_CASN
DDR_CKE0: U2.K9(CKE0) ; port DDR_CKE0
DDR_CLKN: R80.1 TP1402.1 U2.K7(CK#) ; port DDR_CLKN
DDR_CLKP: R79.1 TP1401.1 U2.J7(CK) ; port DDR_CLKP
DDR_CS0N: U2.L2(CS#0) ; port DDR_CS0N
DDR_D0: U2.A2(DQ13) ; port DDR_D0
DDR_D1: U2.A3(DQ15) ; port DDR_D1
DDR_D2: U2.C2(DQ11) ; port DDR_D2
DDR_D3: U2.A7(DQ12) ; port DDR_D3
DDR_D4: U2.D7(DQ8) ; port DDR_D4
DDR_D5: U2.C3(DQ9) ; port DDR_D5
DDR_D6: U2.C8(DQ10) ; port DDR_D6
DDR_D7: U2.B8(DQ14) ; port DDR_D7
DDR_D8: U2.G2(DQ6) ; port DDR_D8
DDR_D9: U2.H7(DQ7) ; port DDR_D9
DDR_D10: U2.F8(DQ3) ; port DDR_D10
DDR_D11: U2.H3(DQ4) ; port DDR_D11
DDR_D12: U2.F7(DQ1) ; port DDR_D12
DDR_D13: U2.F2(DQ2) ; port DDR_D13
DDR_D14: U2.H8(DQ5) ; port DDR_D14
DDR_D15: U2.E3(DQ0) ; port DDR_D15
DDR_DM0: U2.D3(UDM) ; port DDR_DM0
DDR_DM1: U2.E7(LDM) ; port DDR_DM1
DDR_DQS0N: U2.B7(UDQS#) ; port DDR_DQS0N
DDR_DQS0P: U2.C7(UDQS) ; port DDR_DQS0P
DDR_DQS1N: U2.G3(LDQS#) ; port DDR_DQS1N
DDR_DQS1P: U2.F3(LDQS) ; port DDR_DQS1P
DDR_ODT0: U2.K1(ODT0) ; port DDR_ODT0
DDR_RASN: U2.J3(RAS#) ; port DDR_RASN
DDR_RESET: C68.1 U2.T2(RESET#) ; port DDR_RESET
DDR_WEN: U2.L3(WE#) ; port DDR_WEN
N77160221: C67.1 R79.2 R80.2
N77404740: R76.1 U2.L8(ZQ0)

Not connected (* = marked no-connect by the designer): U2 J1(ODT1) J9(CKE1) L1(CS#1) L9(ZQ1) M7(A15)

### Notes on the sheet
- DDR3 1x16bit
- Remind: Refer to the latest AVL for parts selection.
- Title
- Size:
- Date:
- A3
- Engineer:
- Time:
- Revision:
- Sheet
- of
- File:

### Library data of the parts
C63 = CAP_NP_2: cap,1.00uF,+/-10%,10V,X5R,C0402; Manufacturer: TDK; RK_PN: C1005X5R1A105K050BB; Priority: A; Tolerance: 10%; Created_by: JJJ; Source_Path: Z:\RK_STANDARD_LIBRARY\CADENCE_CIS\RK_DISCRETE.OLB; Part_Type: C0402; Manufacturer_PN: C1005X5R1A105K050BB; PCB DECAL: C0402
C64 C65 = CAP_NP_2: cap,1.00nF,+/-10%,50V,X5R,C0402; Manufacturer: TDK; RK_PN: C1005X5R1H102K050BA; Priority: A; Tolerance: 10%; Created_by: JJJ; Source_Path: Z:\RK_STANDARD_LIBRARY\CADENCE_CIS\RK_DISCRETE.OLB; Number: 1; Part_Type: C0402; Manufacturer_PN: C1005X5R1H102K050BA; PCB DECAL: C0402
  C64: C_Voltage: 50V
C67 = CAP_NP_2: cap,100.00pF,+/-10%,50V,C0G,C0402; Manufacturer: TDK; Number: 1; RK_PN: C1005C0G1H101K050BA; Priority: A; Tolerance: 10%; C_Voltage: 6.3V; Created_by: JJJ; Source_Path: Z:\RK_STANDARD_LIBRARY\CADENCE_CIS\RK_DISCRETE.OLB; PCB DECAL: C0402; Part_Type: C0402; Manufacturer_PN: C1005C0G1H101K050BA
C68 = CAP_NP_2: cap,100.00nF,+/-10%,16V,X5R,C0402; Manufacturer: TDK; Number: 1; RK_PN: C1005X5R1C104K050BA; Priority: A; Tolerance: 10%; C_Voltage: 6.3V; Created_by: JJJ; Source_Path: Z:\RK_STANDARD_LIBRARY\CADENCE_CIS\RK_DISCRETE.OLB; Part_Type: C0402; Manufacturer_PN: C1005X5R1C104K050BA; PCB DECAL: C0402
C73 = CAP_NP_2: cap,1.00nF,+/-10%,50V,X5R,C0402; Manufacturer_PN: C1005X5R1H102K050BA; Manufacturer: TDK; Created_by: JJJ; Tolerance: 10%; Priority: A; Source_Path: Z:\RK_STANDARD_LIBRARY\CADENCE_CIS\RK_DISCRETE.OLB; Number: 1; C_Voltage: 50V; Part_Type: C0402; RK_PN: C1005X5R1H102K050BA; PCB DECAL: C0402
C74 C75 C85 C89 = CAP_NP_2: as C31 on sheet 13_ACODEC; Part_Type: C0402; RK_PN: C1005X5R1C104K050BA; PCB DECAL: C0402
C88 = CAP_NP_2: cap,10.00uF,+/-10%,6.3V,X5R,C0603; Manufacturer_PN: C1608X5R0J106K080AB; Manufacturer: TDK; Created_by: JJJ; Tolerance: 10%; Priority: A; Source_Path: Z:\RK_STANDARD_LIBRARY\CADENCE_CIS\RK_DISCRETE.OLB; Number: 1; Part_Type: C0603; RK_PN: C1608X5R0J106K080AB; PCB DECAL: C0603
C90 = CAP_NP_2: as C102 on sheet 13_ACODEC; Part_Type: C0402; Manufacturer_PN: C1005X5R1C104K050BA; PCB DECAL: C0402
R76 = RESISTOR: ?用厚膜电阻,240R,+/-1%,R0402,1/16W.; Manufacturer: YAGEO; RK_PN: RC0402FR-07240RL; Priority: A; Wattage: 1/16W; Created_by: YTL; Source_Path: Z:\RK_STANDARD_LIBRARY\CADENCE_CIS\RK_DISCRETE.OLB; Part_Type: ?用厚膜电阻; Manufacturer_PN: RC0402FR-07240RL; PCB DECAL: R0402
R77 = RESISTOR: ?用厚膜电阻,1K,+/-1%,R0402,1/16W.; Manufacturer: YAGEO; RK_PN: RC0402FR-071KL; Priority: A; Wattage: 1/16W; Created_by: YTL; Source_Path: Z:\RK_STANDARD_LIBRARY\CADENCE_CIS\RK_DISCRETE.OLB; PCB DECAL: R0402; Part_Type: ?用厚膜电阻; Manufacturer_PN: RC0402FR-071KL
R78 = RESISTOR: ?用厚膜电阻,1K,+/-1%,R0402,1/16W.; Manufacturer_PN: RC0402FR-071KL; Manufacturer: YAGEO; Created_by: YTL; Wattage: 1/16W; Priority: A; Source_Path: Z:\RK_STANDARD_LIBRARY\CADENCE_CIS\RK_DISCRETE.OLB; PCB DECAL: R0402; Part_Type: ?用厚膜电阻; RK_PN: RC0402FR-071KL
R79 R80 = RESISTOR: ?用厚膜电阻,49R9,+/-1%,R0402,1/16W.; Manufacturer: YAGEO; RK_PN: RC0402FR-0749R9L; Priority: A; Wattage: 1/16W; Created_by: YTL; Source_Path: Z:\RK_STANDARD_LIBRARY\CADENCE_CIS\RK_DISCRETE.OLB; PCB DECAL: R0402; Part_Type: ?用厚膜电阻; Manufacturer_PN: RC0402FR-0749R9L
TP1401 TP1402 = TP: Test Point 0.7mm; RK PN: TESTPOINT_0R7; Priority: A; Part Type: TP; Created by: JJJ
U2 = DDR3_16BIT: 2Gb/M15T1G1664A-DEBG2CS; Part_Type: DRAM; Manufacturer: ESMT; Manufacturer_PN: M15T2G16128A-DEBG2L; RK_PN: DDR3; Priority: A; Created_by: JJJ; Source_Path: Z:\RK_STANDARD_LIBRARY\CADENCE_CIS\RK_IC.OLB; Number: 1; PCB DECAL: FBGA96_14R00X11R00X1R20

## Sheet 15_FLASH-NAND_FLASH.SchDoc: P30L
size A3; Organization: 六零加智能科技; Address4: www.nidone.com.cn; DocumentNumber: Kang jin; Revision: 1.0; SheetNumber: 15; SheetTotal: 23
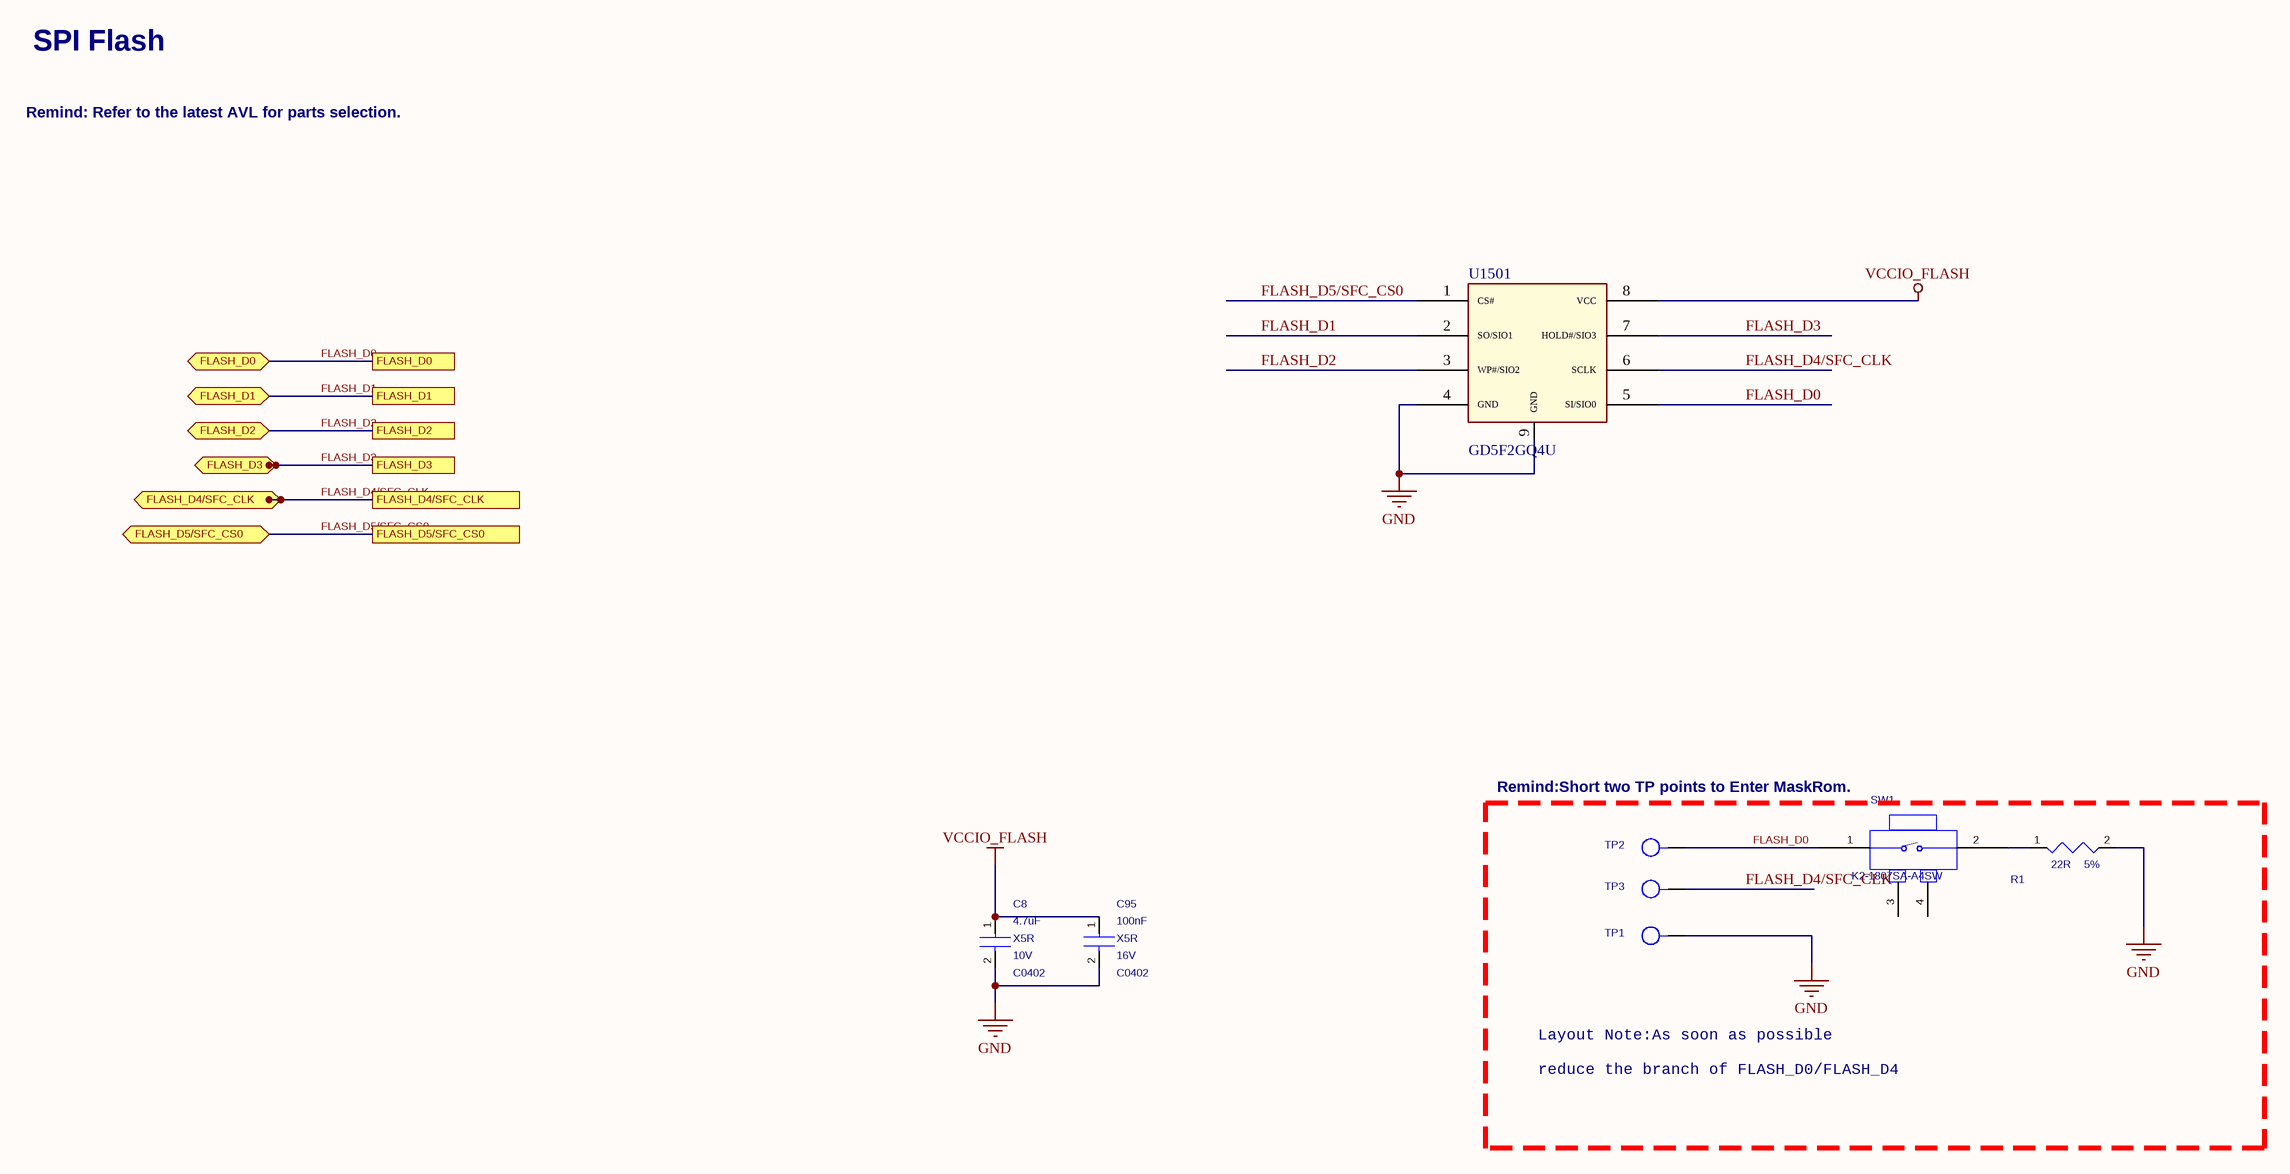
[diagram p26: 15_FLASH-NAND_FLASH.SchDoc]

### Parts
C8  value 4.7uF  Dielectric: X5R  Voltage: 10V  [C0402]  (hidden comment: CAP_NP_2)
C95  value 100nF  Voltage: 16V  Dielectric: X5R  [C0402]  (hidden comment: CAP_NP_2)
R1  value 22R  Tolerance: 5%  [R0402]  (hidden comment: RESISTOR)
SW1  K2-1807SA-A4SW  [P2]
TP1  TP  [TEST]  (value not drawn)
TP2  TP  [TEST]  (value not drawn)
TP3  TP  [TEST]  (value not drawn)
U1501  GD5F2GQ4U  [LGA8]

### Ports
FLASH_D0, FLASH_D0 (bidir), FLASH_D1, FLASH_D1 (bidir), FLASH_D2, FLASH_D2 (bidir), FLASH_D3, FLASH_D3 (bidir), FLASH_D4/SFC_CLK, FLASH_D4/SFC_CLK (bidir), FLASH_D5/SFC_CS0, FLASH_D5/SFC_CS0 (bidir)

### Nets
GND: C8.2 C95.2 R1.2 TP1.1 U1501.4(GND) U1501.9(GND)
VCCIO_FLASH: C8.1 C95.1 U1501.8(VCC)  [project net VCC_IO]
FLASH_D0: SW1.1 TP2.1 U1501.5(SI/SIO0) ; port FLASH_D0
FLASH_D1: U1501.2(SO/SIO1) ; port FLASH_D1
FLASH_D2: U1501.3(WP#/SIO2) ; port FLASH_D2
FLASH_D3: U1501.7(HOLD#/SIO3) ; port FLASH_D3
FLASH_D4/SFC_CLK: TP3.1 U1501.6(SCLK) ; port FLASH_D4/SFC_CLK
FLASH_D5/SFC_CS0: U1501.1(CS#) ; port FLASH_D5/SFC_CS0
NetR1_1: R1.1 SW1.2

Not connected (* = marked no-connect by the designer): SW1 3 4

### Notes on the sheet
- SPI Flash
- Remind: Refer to the latest AVL for parts selection.
- Remind:Short two TP points to Enter MaskRom.
- Layout Note:As soon as possible
- reduce the branch of FLASH_D0/FLASH_D4
- Title
- Size:
- Date:
- A3
- Engineer:
- Time:
- Revision:
- Sheet
- of
- File:

### Library data of the parts
C8 = CAP_NP_2: as C103 on sheet 13_ACODEC; Part_Type: C0402; Manufacturer_PN: C1005X5R1A475K050BC; PCB DECAL: C0402
C95 = CAP_NP_2: as C31 on sheet 13_ACODEC; Part_Type: C0402; RK_PN: C1005X5R1C104K050BA; PCB DECAL: C0402
R1 = RESISTOR: ?用厚膜电阻,22R,+/-5%,R0402,1/16W.; Manufacturer: YAGEO; RK_PN: RC0402JR-0722RL; Priority: A; Wattage: 1/16W; Created_by: YTL; Source_Path: Z:\RK_STANDARD_LIBRARY\CADENCE_CIS\RK_DISCRETE.OLB; number: 1; PCB DECAL: R0402; Part_Type: ?用厚膜电阻; Manufacturer_PN: RC0402JR-0722RL
SW1 = K2-1807SA-A4SW: Part_Type: SWITCH; Manufacturer: HRO; Remark: 连接器; Number: 1; PCB DECAL: K2-1807SA; Value: K2-1807SA-A4SW; Manufacturer_PN: K2-1807SA-A4SW
TP1-TP3 = TP: PCB DECAL: PAD_10; Source_Path: Z:\CAPTURE_CIS\REFERENCE\SYMBOL\TP.OLB; reserve: DEPOP; Option: DNP
U1501 = GD5F2Q4U

## Sheet 18_AUDIO_PowerAmp-AnalogT.SchDoc: P30L
size A3; Organization: 六零加智能科技; Address4: www.nidone.com.cn; DocumentNumber: Kang jin; Revision: 1.0; SheetNumber: 16; SheetTotal: 23; Rule: 1.0
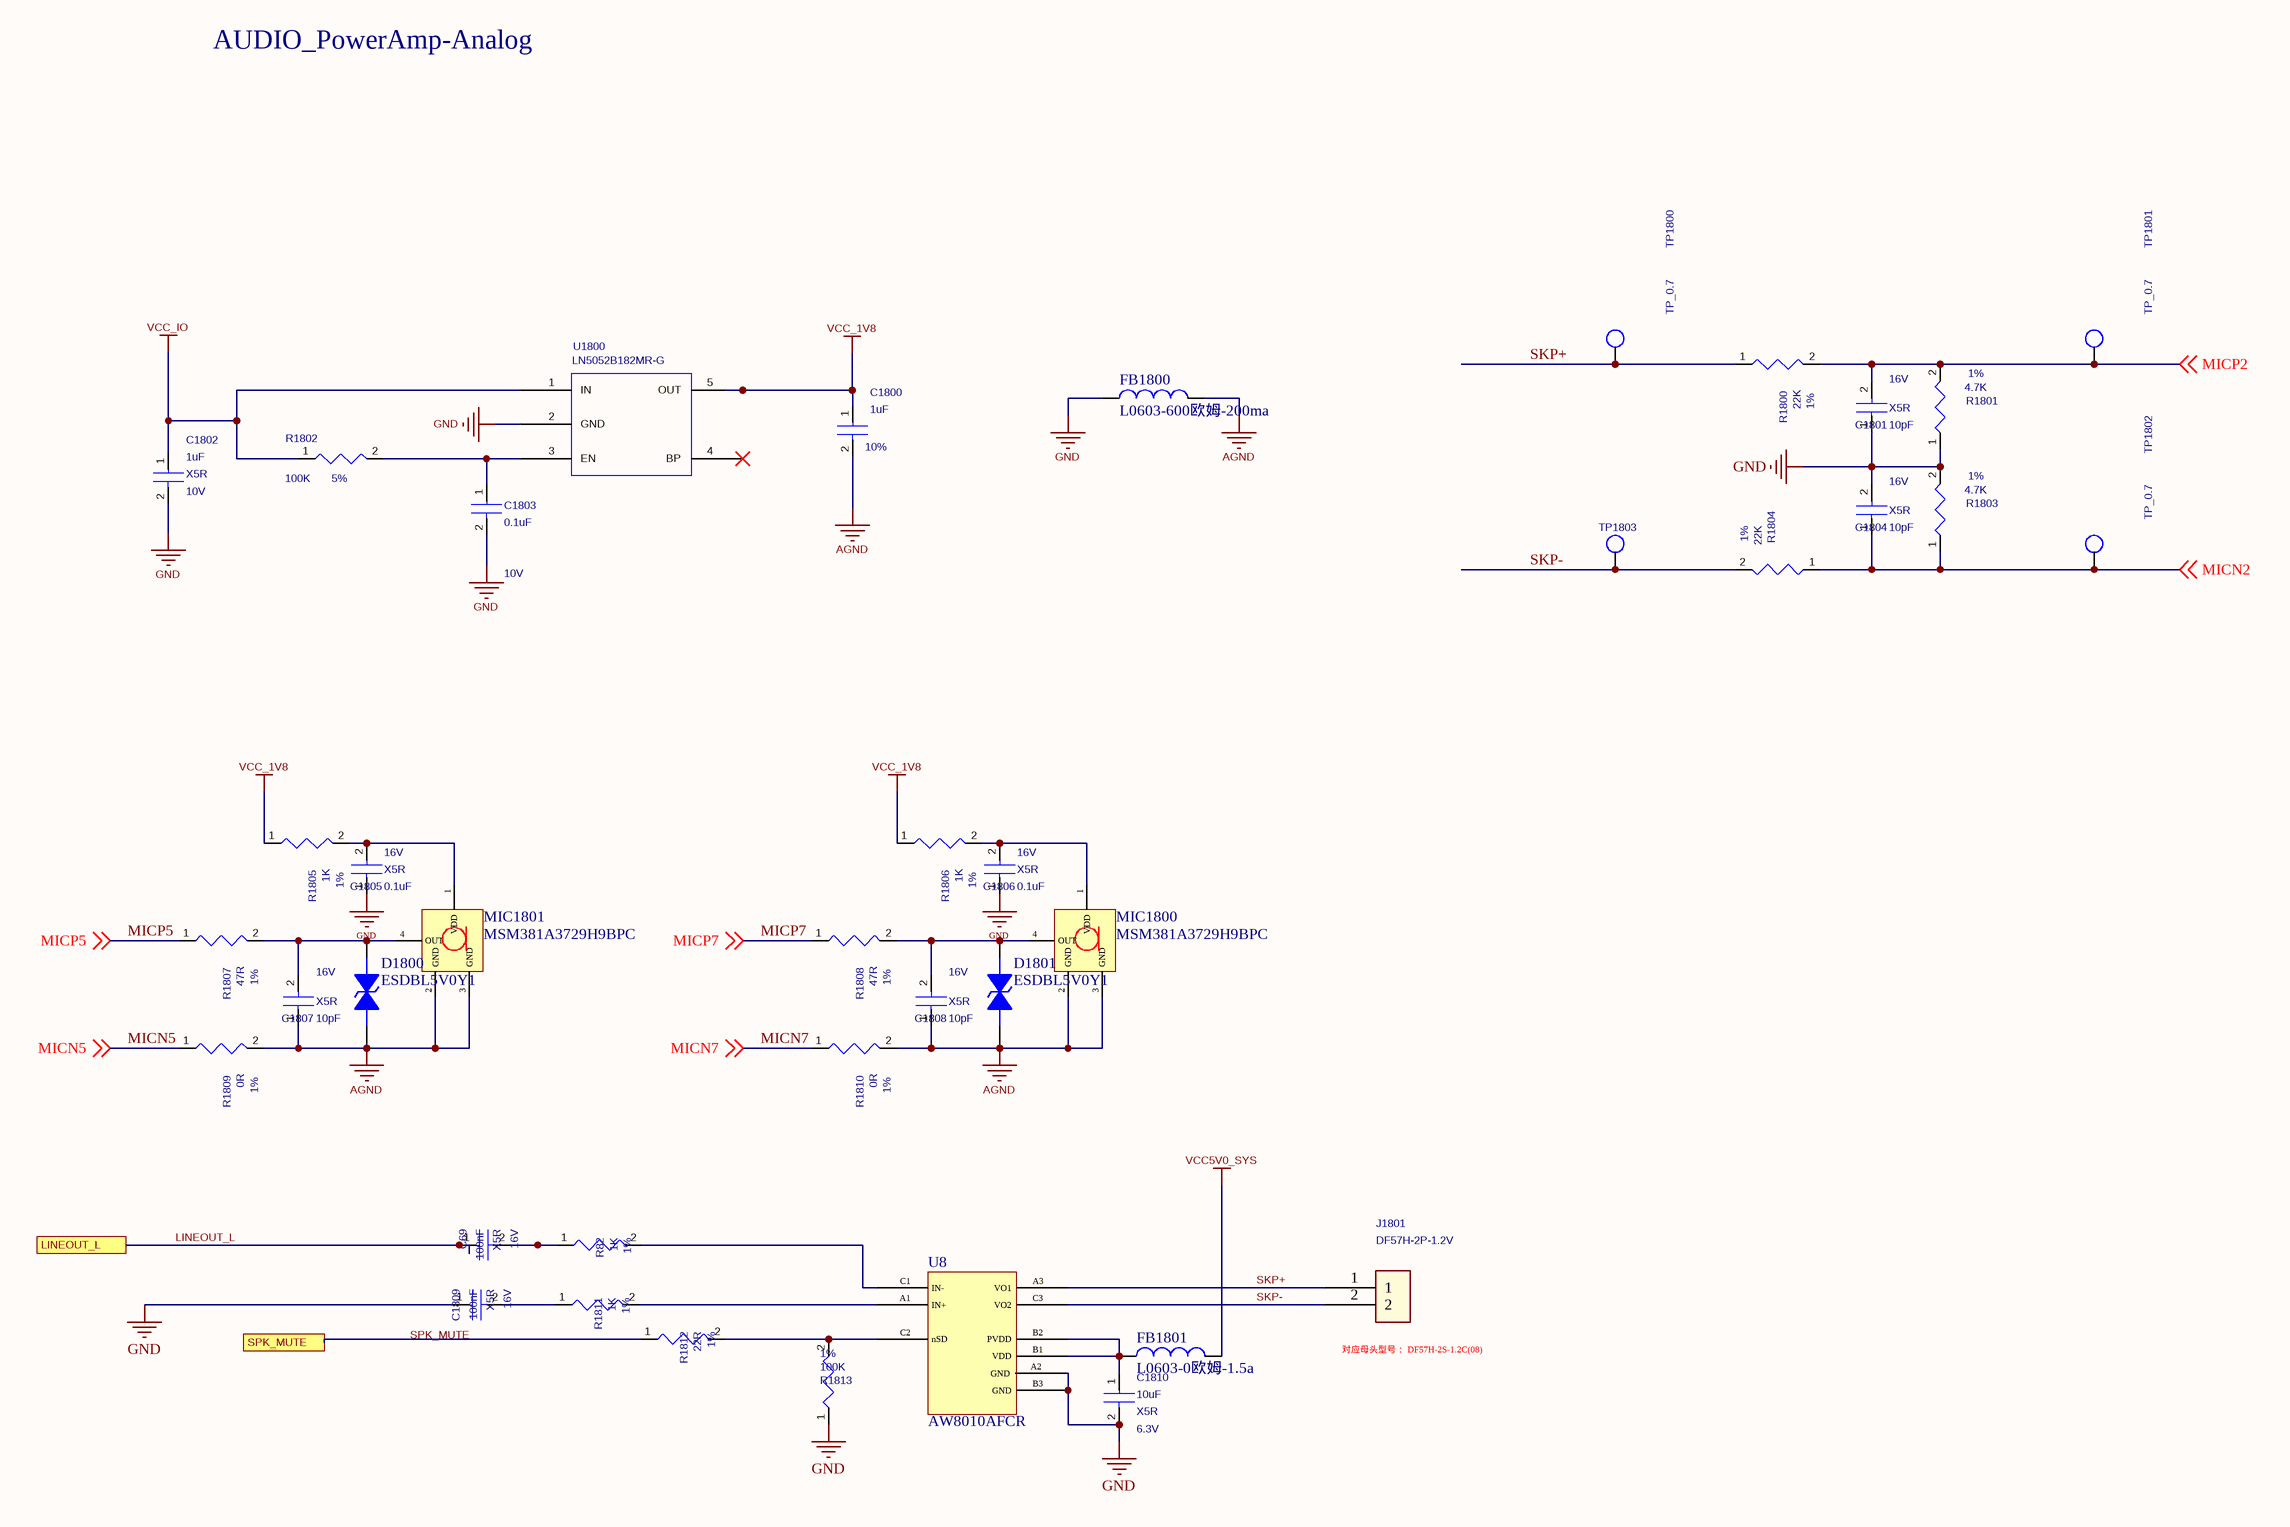
[diagram p27: 18_AUDIO_PowerAmp-AnalogT.SchDoc]

### Parts
C69  value 100nF  Voltage: 16V  Dielectric: X5R  [C0402]  (hidden comment: CAP_NP_2)
C1800  value 1uF  Tolerance: 10%  [C0402]  (hidden comment: CAP_NP_2)
C1801  value 10pF  Voltage: 16V  Dielectric: X5R  [C0402]  (hidden comment: CAP_NP_2)
C1802  value 1uF  Voltage: 10V  Dielectric: X5R  [C0402]  (hidden comment: CAP_NP_2)
C1803  value 0.1uF  Voltage: 10V  [C0402]  (hidden comment: CAP_NP_2)
C1804  value 10pF  Voltage: 16V  Dielectric: X5R  [C0402]  (hidden comment: CAP_NP_2)
C1805  value 0.1uF  Voltage: 16V  Dielectric: X5R  [C0402]  (hidden comment: CAP_NP_2)
C1806  value 0.1uF  Voltage: 16V  Dielectric: X5R  [C0402]  (hidden comment: CAP_NP_2)
C1807  value 10pF  Voltage: 16V  Dielectric: X5R  [C0402]  (hidden comment: CAP_NP_2)
C1808  value 10pF  Voltage: 16V  Dielectric: X5R  [C0402]  (hidden comment: CAP_NP_2)
C1809  value 100nF  Voltage: 16V  Dielectric: X5R  [C0402]  (hidden comment: CAP_NP_2)
C1810  value 10uF  Dielectric: X5R  Voltage: 6.3V  [C0603]  (hidden comment: CAP_NP_2)
D1800  ESDBL5V0Y1  [E0402N]
D1801  ESDBL5V0Y1  [E0402N]
FB1800  L0603-600欧姆-200ma  [L0402]
FB1801  L0603-0欧姆-1.5a  [L0402]
J1801  DF57H-2P-1.2V  [PH插座]
MIC1800  MSM381A3729H9BPC  [MEMS-4pin]
MIC1801  MSM381A3729H9BPC  [MEMS-4pin]
R82  value 1K  Tolerance: 1%  [R0402]  (hidden comment: RESISTOR)
R1800  value 22K  Tolerance: 1%  [R0402]  (hidden comment: RESISTOR)
R1801  value 4.7K  Tolerance: 1%  [R0402]  (hidden comment: RESISTOR)
R1802  value 100K  Tolerance: 5%  [R0402]  (hidden comment: RESISTOR)
R1803  value 4.7K  Tolerance: 1%  [R0402]  (hidden comment: RESISTOR)
R1804  value 22K  Tolerance: 1%  [R0402]  (hidden comment: RESISTOR)
R1805  value 1K  Tolerance: 1%  [R0402]  (hidden comment: RESISTOR)
R1806  value 1K  Tolerance: 1%  [R0402]  (hidden comment: RESISTOR)
R1807  value 47R  Tolerance: 1%  [R0402]  (hidden comment: RESISTOR)
R1808  value 47R  Tolerance: 1%  [R0402]  (hidden comment: RESISTOR)
R1809  value 0R  Tolerance: 1%  [R0402]  (hidden comment: RESISTOR)
R1810  value 0R  Tolerance: 1%  [R0402]  (hidden comment: RESISTOR)
R1811  value 1K  Tolerance: 1%  [R0402]  (hidden comment: RESISTOR)
R1812  value 22R  Tolerance: 1%  [R0402]  (hidden comment: RESISTOR)
R1813  value 100K  Tolerance: 1%  [R0402]  (hidden comment: RESISTOR)
TP1800  TP_0.7  [TEST]
TP1801  TP_0.7  [TEST]
TP1802  TP_0.7  [TEST]
TP1803  TP_0.7  [TEST]  (value not drawn)
U8  AW8010AFCR  [FC-9]
U1800  LN5052B182MR-G  [SOT_23_5]

### Ports
LINEOUT_L, SPK_MUTE

### Nets
AGND: C1800.2 C1807.1 C1808.1 D1800.1 D1801.1 FB1800.2 MIC1800.2(GND) MIC1800.3(GND) MIC1801.2(GND) MIC1801.3(GND) R1809.2 R1810.2
GND: C1801.1 C1802.2 C1803.2 C1804.2 C1805.1 C1806.1 C1809.1 C1810.2 FB1800.1 R1801.1 R1803.2 R1813.1 U8.A2(GND) U8.B3(GND) U1800.2(GND)
VCC5V0_SYS: FB1801.2
VCC_1V8: C1800.1 R1805.1 R1806.1 U1800.5(OUT)
VCC_IO: C1802.1 R1802.1 U1800.1(IN)
LINEOUT_L: C69.1 ; port LINEOUT_L
MICN2: C1804.1 R1803.1 R1804.1 TP1802.1 ; off-sheet MICN2
MICN5: R1809.1 ; off-sheet MICN5
MICN7: R1810.1 ; off-sheet MICN7
MICP2: C1801.2 R1800.2 R1801.2 TP1801.1 ; off-sheet MICP2
MICP5: R1807.1 ; off-sheet MICP5
MICP7: R1808.1 ; off-sheet MICP7
SKP+: J1801.1 R1800.1 TP1800.1 U8.A3(VO1)
SKP-: J1801.2 R1804.2 TP1803.1 U8.C3(VO2)
SPK_MUTE: R1812.1 ; port SPK_MUTE
NetC69_2: C69.2 R82.1
NetC1803_1: C1803.1 R1802.2 U1800.3(EN)
NetC1805_2: C1805.2 MIC1801.1(VDD) R1805.2
NetC1806_2: C1806.2 MIC1800.1(VDD) R1806.2
NetC1807_2: C1807.2 D1800.2 MIC1801.4(OUT) R1807.2
NetC1808_2: C1808.2 D1801.2 MIC1800.4(OUT) R1808.2
NetC1809_2: C1809.2 R1811.1
NetC1810_1: C1810.1 FB1801.1 U8.B1(VDD) U8.B2(PVDD)
NetR82_2: R82.2 U8.C1(IN-)
NetR1811_2: R1811.2 U8.A1(IN+)
NetR1812_2: R1812.2 R1813.2 U8.C2(nSD)

Not connected (* = marked no-connect by the designer): U1800 4(BP)*

### Notes on the sheet
- AUDIO_PowerAmp-Analog
- (near J1801) 对应母头型号： DF57H-2S-1.2C(08)
- Labels drawn without touching a wire or pin: SPK_MUTE
- Title
- Size:
- Date:
- A3
- Engineer:
- Time:
- Revision:
- Sheet
- of
- File:

### Library data of the parts
C69 C1809 = CAP_NP_2: as C31 on sheet 13_ACODEC; PCB DECAL: C0402; Part_Type: C0402; RK_PN: C1005X5R1C104K050BA
C1800 = CAP_NP_2: cap,1.00uF,+/-10%,10V,X5R,C0402; Manufacturer_PN: C1005X5R1A105K050BB; Manufacturer: TDK; Created_by: JJJ; C_Voltage: 6.3V; Priority: A; Source_Path: Z:\RK_STANDARD_LIBRARY\CADENCE_CIS\RK_DISCRETE.OLB; PCB DECAL: C0402; Voltage: 10V; Dielectric: X5R; Part_Type: C0402; RK_PN: C1005X5R1A105K050BB
C1801 C1804 = CAP_NP_2: cap,1nF,+/-10%,16V,X5R,C0402; Manufacturer_PN: C1005X5R1C104K050BA; Manufacturer: TDK; Created_by: JJJ; Tolerance: 10%; Priority: A; Source_Path: Z:\RK_STANDARD_LIBRARY\CADENCE_CIS\RK_DISCRETE.OLB; Number: 1; PCB DECAL: C0402; Part_Type: C0402; RK_PN: C1005X5R1C104K050BA
C1802 = CAP_NP_2: cap,1.00uF,+/-10%,10V,X5R,C0402; Manufacturer: TDK; RK_PN: C1005X5R1A105K050BB; Priority: A; C_Voltage: 6.3V; Tolerance: 10%; Created_by: JJJ; Source_Path: Z:\RK_STANDARD_LIBRARY\CADENCE_CIS\RK_DISCRETE.OLB; PCB DECAL: C0402; Part_Type: C0402; Manufacturer_PN: C1005X5R1A105K050BB
C1803 = CAP_NP_2: cap,0.1uF,+/-10%,10V,X5R,C0402; Manufacturer: TDK; RK_PN: C1005X5R1A105K050BB; Priority: A; C_Voltage: 6.3V; Tolerance: 10%; Created_by: JJJ; Source_Path: Z:\RK_STANDARD_LIBRARY\CADENCE_CIS\RK_DISCRETE.OLB; Part_Type: C0402; Dielectric: X5R; Manufacturer_PN: C1005X5R1A105K050BB; PCB DECAL: C0402
C1805 C1806 = CAP_NP_2: cap,0.1uF,+/-10%,16V,X5R,C0402; Manufacturer_PN: C1005X5R1C104K050BA; Manufacturer: TDK; Created_by: JJJ; Tolerance: 10%; Priority: A; Source_Path: Z:\RK_STANDARD_LIBRARY\CADENCE_CIS\RK_DISCRETE.OLB; Number: 1; PCB DECAL: C0402; Part_Type: C0402; RK_PN: C1005X5R1C104K050BA
C1807 C1808 = CAP_NP_2: cap,10pF,+/-10%,16V,X5R,C0402; Manufacturer_PN: C1005X5R1C104K050BA; Manufacturer: TDK; Created_by: JJJ; Tolerance: 10%; Priority: A; Source_Path: Z:\RK_STANDARD_LIBRARY\CADENCE_CIS\RK_DISCRETE.OLB; Number: 1; PCB DECAL: C0402; Part_Type: C0402; RK_PN: C1005X5R1C104K050BA
C1810 = CAP_NP_2: cap,10.00uF,+/-10%,6.3V,X5R,C0603; Manufacturer: TDK; RK_PN: C1608X5R0J106K080AB; Priority: A; Tolerance: 10%; Created_by: JJJ; Source_Path: Z:\RK_STANDARD_LIBRARY\CADENCE_CIS\RK_DISCRETE.OLB; Number: 1; PCB DECAL: C0603; Part_Type: C0603; Manufacturer_PN: C1608X5R0J106K080AB
D1800 D1801 = TVS
FB1800 FB1801 = INDUCTOR: L0603-0欧姆-1A
J1801 = CON2_1X2: Manufacturer Part Number: CW2001-02G-S03-C; Manufacturer: 褀华电子; Priority: A; Created by: YWQ; Part Type: Header; RK PN: CW2001-02G-S03-C
MIC1800 MIC1801 = MIC
R82 R1805 R1806 R1811 = RESISTOR: as R78 on sheet 14_RAM-DDR3_1X16BIT; PCB DECAL: R0402; Part_Type: ?用厚膜电阻; RK_PN: RC0402FR-071KL
R1800 R1804 = RESISTOR: ?用厚膜电阻,22K,+/-1%,R0402,1/16W.; Manufacturer_PN: RC0402FR-071KL; Manufacturer: YAGEO; Created_by: YTL; Wattage: 1/16W; Priority: A; Source_Path: Z:\RK_STANDARD_LIBRARY\CADENCE_CIS\RK_DISCRETE.OLB; PCB DECAL: R0402; Part_Type: ?用厚膜电阻; RK_PN: RC0402FR-071KL
R1801 = RESISTOR: ?用厚膜电阻,4.7K+/-1%,R0402,1/16W.; Manufacturer_PN: RC0402FR-071KL; Manufacturer: YAGEO; Created_by: YTL; Wattage: 1/16W; Priority: A; Source_Path: Z:\RK_STANDARD_LIBRARY\CADENCE_CIS\RK_DISCRETE.OLB; PCB DECAL: R0402; Part_Type: ?用厚膜电阻; RK_PN: RC0402FR-071KL
R1802 = RESISTOR: ?用厚膜电阻,100K,+/-5%,R0402,1/16W.; Manufacturer: YAGEO; RK_PN: RC0402JR-07100KL; Priority: A; Wattage: 1/16W; Created_by: YTL; Source_Path: Z:\RK_STANDARD_LIBRARY\CADENCE_CIS\RK_DISCRETE.OLB; Number: 1; PCB DECAL: R0402; Part_Type: ?用厚膜电阻; Manufacturer_PN: RC0402JR-07100KL
R1803 = RESISTOR: ?用厚膜电阻,4.7K,+/-1%,R0402,1/16W.; Manufacturer_PN: RC0402FR-071KL; Manufacturer: YAGEO; Created_by: YTL; Wattage: 1/16W; Priority: A; Source_Path: Z:\RK_STANDARD_LIBRARY\CADENCE_CIS\RK_DISCRETE.OLB; PCB DECAL: R0402; Part_Type: ?用厚膜电阻; RK_PN: RC0402FR-071KL
R1807 R1808 = RESISTOR: ?用厚膜电阻,47R,+/-1%,R0402,1/16W.; Manufacturer_PN: RC0402FR-071KL; Manufacturer: YAGEO; Created_by: YTL; Wattage: 1/16W; Priority: A; Source_Path: Z:\RK_STANDARD_LIBRARY\CADENCE_CIS\RK_DISCRETE.OLB; PCB DECAL: R0402; Part_Type: ?用厚膜电阻; RK_PN: RC0402FR-071KL
R1809 R1810 = RESISTOR: ?用厚膜电阻,0R,+/-1%,R0402,1/16W.; Manufacturer_PN: RC0402FR-071KL; Manufacturer: YAGEO; Created_by: YTL; Wattage: 1/16W; Priority: A; Source_Path: Z:\RK_STANDARD_LIBRARY\CADENCE_CIS\RK_DISCRETE.OLB; PCB DECAL: R0402; Part_Type: ?用厚膜电阻; RK_PN: RC0402FR-071KL
R1812 = RESISTOR: ?用厚膜电阻,22R,+/-1%,R0402,1/16W.; Manufacturer_PN: RC0402FR-071KL; Manufacturer: YAGEO; Created_by: YTL; Wattage: 1/16W; Priority: A; Source_Path: Z:\RK_STANDARD_LIBRARY\CADENCE_CIS\RK_DISCRETE.OLB; PCB DECAL: R0402; Part_Type: ?用厚膜电阻; RK_PN: RC0402FR-071KL
R1813 = RESISTOR: ?用厚膜电阻,100K,+/-1%,R0402,1/16W.; Manufacturer_PN: RC0402FR-071KL; Manufacturer: YAGEO; Created_by: YTL; Wattage: 1/16W; Priority: A; Source_Path: Z:\RK_STANDARD_LIBRARY\CADENCE_CIS\RK_DISCRETE.OLB; PCB DECAL: R0402; Part_Type: ?用厚膜电阻; RK_PN: RC0402FR-071KL
TP1800-TP1803 = TP: as TP1401 on sheet 14_RAM-DDR3_1X16BIT; Part Type: TP; Created by: JJJ
U8 = U
U1800 = LDO_PT5108: High-PSRR 600mA LDO.Output1.8V.; Part_Type: LDO; Manufacturer: Powtech(华润矽威）; RK_PN: ME6212C18M5G; Priority: A; Created_by: JJJ; Source_Path: Z:\RK_STANDARD_LIBRARY\CADENCE_CIS\RK_IC.OLB; Number: 1; PCB DECAL: SOT_23_5; Manufacturer_PN: LN5052B182MR-G; Value: LN5052B182MR-G

## Sheet 25_USB_OTG.SchDoc: P30L
size A3; Organization: 六零加智能科技; Address4: www.nidone.com.cn; DocumentNumber: kang jin; Revision: 1.0; SheetNumber: 17; SheetTotal: 23
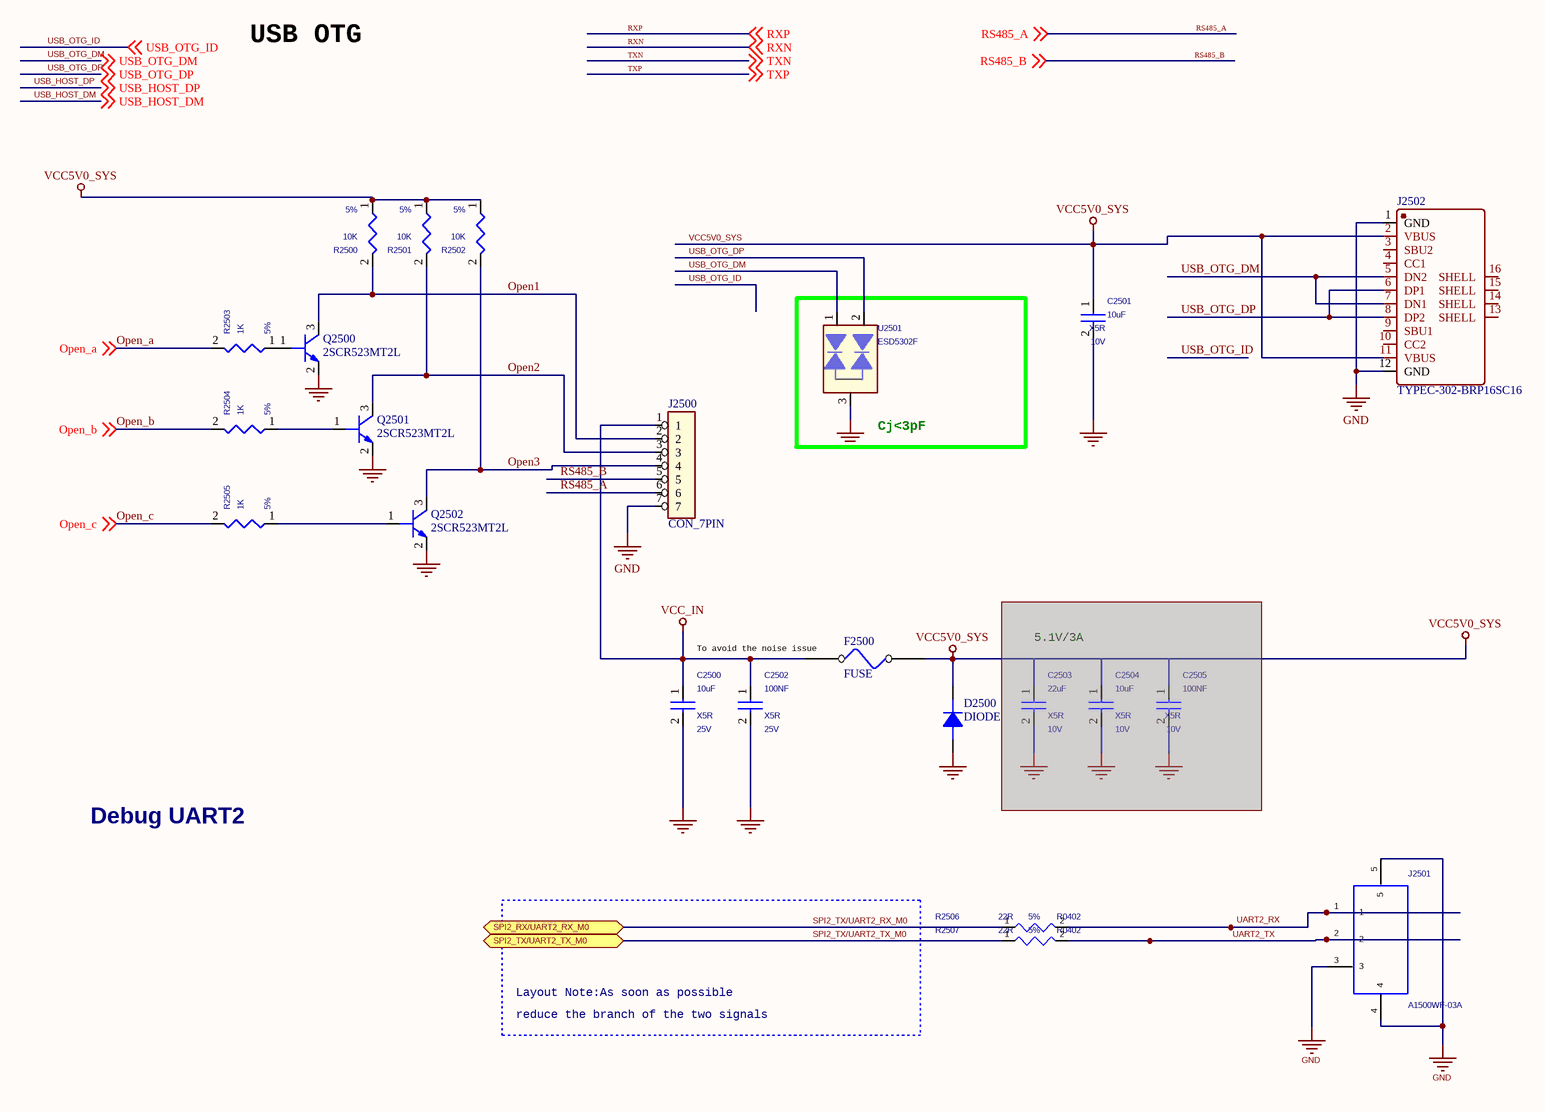
[diagram p28: 25_USB_OTG.SchDoc]

### Parts
C2500  10uF  Voltage: 25V  Dielectric: X5R  [C0805]
C2501  10uF  Voltage: 10V  Dielectric: X5R  [C0603]
C2502  100NF  Voltage: 25V  Dielectric: X5R  [C0402]
C2503  22uF  Voltage: 10V  Dielectric: X5R  [C0805]  (masked out: inside a compile mask, not in the netlist)
C2504  10uF  Voltage: 10V  Dielectric: X5R  [C0805]  (masked out: inside a compile mask, not in the netlist)
C2505  100NF  Voltage: 10V  Dielectric: X5R  [C0402]  (masked out: inside a compile mask, not in the netlist)
D2500  DIODE  [C0805]
F2500  FUSE  [R0805]
J2500  CON_7PIN  [CON_7PIN]
J2501  A1500WF-03A  [TP3]
J2502  TYPEC-302-BRP16SC16  [Type_c]
Q2500  2SCR523MT2L  [SOT-723_L1.2-W0.8-P0.40-LS1.2-BR]
Q2501  2SCR523MT2L  [SOT-723_L1.2-W0.8-P0.40-LS1.2-BR]
Q2502  2SCR523MT2L  [SOT-723_L1.2-W0.8-P0.40-LS1.2-BR]
R2500  10K  Tolerance: 5%  [R0402]
R2501  10K  Tolerance: 5%  [R0402]
R2502  10K  Tolerance: 5%  [R0402]
R2503  1K  Tolerance: 5%  [R0402]
R2504  1K  Tolerance: 5%  [R0402]
R2505  1K  Tolerance: 5%  [R0402]
R2506  value 22R  Tolerance: 5%  [R0402]  (hidden comment: RESISTOR)
R2507  value 22R  Tolerance: 5%  [R0402]  (hidden comment: RESISTOR)
U2501  ESD5302F  [SOT23]

### Blocks framed on the sheet
Cj<3pF: U2501

### Ports
SPI2_RX/UART2_RX_M0 (bidir), SPI2_TX/UART2_TX_M0 (bidir)

### Nets
GND: C2500.2 C2501.2 C2502.2 D2500.1(A) J2500.7 J2501.3 J2501.4 J2501.5 J2502.1(GND) J2502.12(GND) Q2500.2(EMITTER) Q2501.2(EMITTER) Q2502.2(EMITTER) U2501.3
VCC5V0_SYS: C2501.1 D2500.2(K) F2500.2 J2502.2(VBUS) J2502.11(VBUS) R2500.1 R2501.1 R2502.1
VCC_IN: C2500.1 C2502.1 F2500.1 J2500.1
Open1: J2500.2 Q2500.3(COLLECTOR) R2500.2
Open2: J2500.3 Q2501.3(COLLECTOR) R2501.2
Open3: J2500.4 Q2502.3(COLLECTOR) R2502.2
Open_a: R2503.2 ; off-sheet Open_a
Open_b: R2504.2 ; off-sheet Open_b
Open_c: R2505.2 ; off-sheet Open_c
RS485_A: J2500.6 ; off-sheet RS485_A
RS485_B: J2500.5 ; off-sheet RS485_B
RXN: off-sheet RXN
RXP: off-sheet RXP
SPI2_TX/UART2_RX_M0: R2506.1 ; port SPI2_RX/UART2_RX_M0  [project net SPI2_RX/UART2_RX_M0]
SPI2_TX/UART2_TX_M0: R2507.1 ; port SPI2_TX/UART2_TX_M0
TXN: off-sheet TXN
TXP: off-sheet TXP
UART2_TX: J2501.2 R2507.2
USB_HOST_DM: off-sheet USB_HOST_DM
USB_HOST_DP: off-sheet USB_HOST_DP
USB_OTG_DM: J2502.5(DN2) J2502.7(DN1) U2501.1 ; off-sheet USB_OTG_DM
USB_OTG_DP: J2502.6(DP1) J2502.8(DP2) U2501.2 ; off-sheet USB_OTG_DP
USB_OTG_ID: off-sheet USB_OTG_ID
NetJ2501_1: J2501.1 R2506.2
NetQ2500_1: Q2500.1(BASE) R2503.1
NetQ2501_1: Q2501.1(BASE) R2504.1
NetQ2502_1: Q2502.1(BASE) R2505.1

Not connected (* = marked no-connect by the designer): J2502 3(SBU2) 4(CC1) 9(SBU1) 10(CC2) 13(SHELL) 14(SHELL) 15(SHELL) 16(SHELL)

### Notes on the sheet
- USB OTG
- To avoid the noise issue
- 5.1V/3A
- Debug UART2
- Layout Note:As soon as possible
- reduce the branch of the two signals
- Labels drawn without touching a wire or pin: UART2_RX
- Title
- Size:
- Date:
- A3
- Engineer:
- Time:
- Revision:
- Sheet
- of
- File:

### Library data of the parts
C2500 = CAP NP_Dup1: cap,10.00uF,+/-10%,25V,X5R,C0805; Manufacturer PN: C2012X5R1E106K085AC; Manufacturer: TDK; Tolerance: 10%; Priority: A; Created by: JJJ; Part Type: C0805; RK PN: C2012X5R1E106K085AC
C2501 = CAP NP_Dup1: cap,10.00uF,+/-10%,10V,X5R,C0603; Manufacturer: TDK; RK PN: C1608X5R1A106K080AC; Priority: A; Tolerance: 10%; Part Type: C0603; Manufacturer PN: C1608X5R1A106K080AC; Created by: JJJ
C2502 = CAP NP_Dup1: cap,100.00nF,+/-10%,25V,X5R,C0402; Manufacturer: TDK; RK PN: C1005X5R1E104K050BC; Priority: A; Tolerance: 10%; Part Type: C0402; Manufacturer PN: C1005X5R1E104K050BC; Created by: JJJ
C2503 = CAP NP_Dup1: cap,22.00uF,+/-10%,10V,X5R,C0805; Manufacturer PN: C2012X5R1A226K125AB; Manufacturer: TDK; Tolerance: 10%; Priority: A; Created by: JJJ; Part Type: C0805; RK PN: C2012X5R1A226K125AB
C2504 = CAP NP_Dup1: cap,10.00uF,+/-10%,10V,X5R,C0805; Manufacturer: TDK; RK PN: C2012X5R1A106K125AB; Priority: A; Tolerance: 10%; Part Type: C0805; Manufacturer PN: C2012X5R1A106K125AB; Created by: JJJ
C2505 = CAP NP_Dup1: cap,100.00nF,+/-10%,10V,X5R,C0402; Manufacturer PN: C0603X5R1A104K030BC; Manufacturer: TDK; Tolerance: 10%; Priority: A; Created by: JJJ; Part Type: C0402; RK PN: C0603X5R1A104K030BC
J2501 = A1500WF-03A: ZH1.5卧贴针座3PIN; Manufacturer_PN: HZ1515103N5200; PCB DECAL: ZH1.5-3P; Number: 1
J2502 = Type-c
Q2500-Q2502 = NPN
R2500-R2502 = RESISTOR_Dup1: 通用厚膜电阻,10K,+/-5%,R0402,1/16W.; Manufacturer PN: RC0402JR-072KL; Manufacturer: YAGEO; Wattage: 1/16W; Priority: A; Created by: YTL; Part Type: 通用厚膜电阻; RK PN: RC0402JR-072KL
R2503-R2505 = RESISTOR_Dup1: 通用厚膜电阻,1K,+/-5%,R0402,1/16W.; Manufacturer PN: RC0402JR-072KL; Manufacturer: YAGEO; Wattage: 1/16W; Priority: A; Created by: YTL; Part Type: 通用厚膜电阻; RK PN: RC0402JR-072KL
R2506 = RESISTOR: ?用厚膜电阻,22R,+/-5%,R0402,1/16W.; Manufacturer_PN: RC0402JR-0722RL; Manufacturer: YAGEO; Created_by: YTL; Wattage: 1/16W; Priority: A; Source_Path: Z:\RK_STANDARD_LIBRARY\CADENCE_CIS\RK_DISCRETE.OLB; number: 1; PCB DECAL: R0402; Part_Type: ?用厚膜电阻; RK_PN: RC0402JR-0722RL
R2507 = RESISTOR: as R1 on sheet 15_FLASH-NAND_FLASH; PCB DECAL: R0402; Part_Type: ?用厚膜电阻; Manufacturer_PN: RC0402JR-0722RL
U2501 = ESD_ESDA6V8UL: 2-Lines, Uni-directional,Ultra-low Capacitance.Transient Voltage Suppressors; Manufacturer: WillSemi(韦尔半导体); Priority: A; RK PN: ESD5302F; Part Type: ESD_TVS; Manufacturer PN: ESD5302F; Created by: JJJ